# Altium schematic sheet acf_schematic.SchDoc: Устройство сжатия
size 1188 x 840 mm; CheckedBy: Леонидов В.В.; Author: Добротин А.А.; SheetNumber: 1; SheetTotal: 2; CompanyName1: МГТУ им. Н.Э.Баумана; CompanyName2: Кафедра ИУ4; CompanyName3: Группа ИУ4-81Б; Title2str: аудиоданных; DocumentType: Схема электрическая принципиальная; Scale: 1:1; FirstReferrence: АБВГ.123456.001
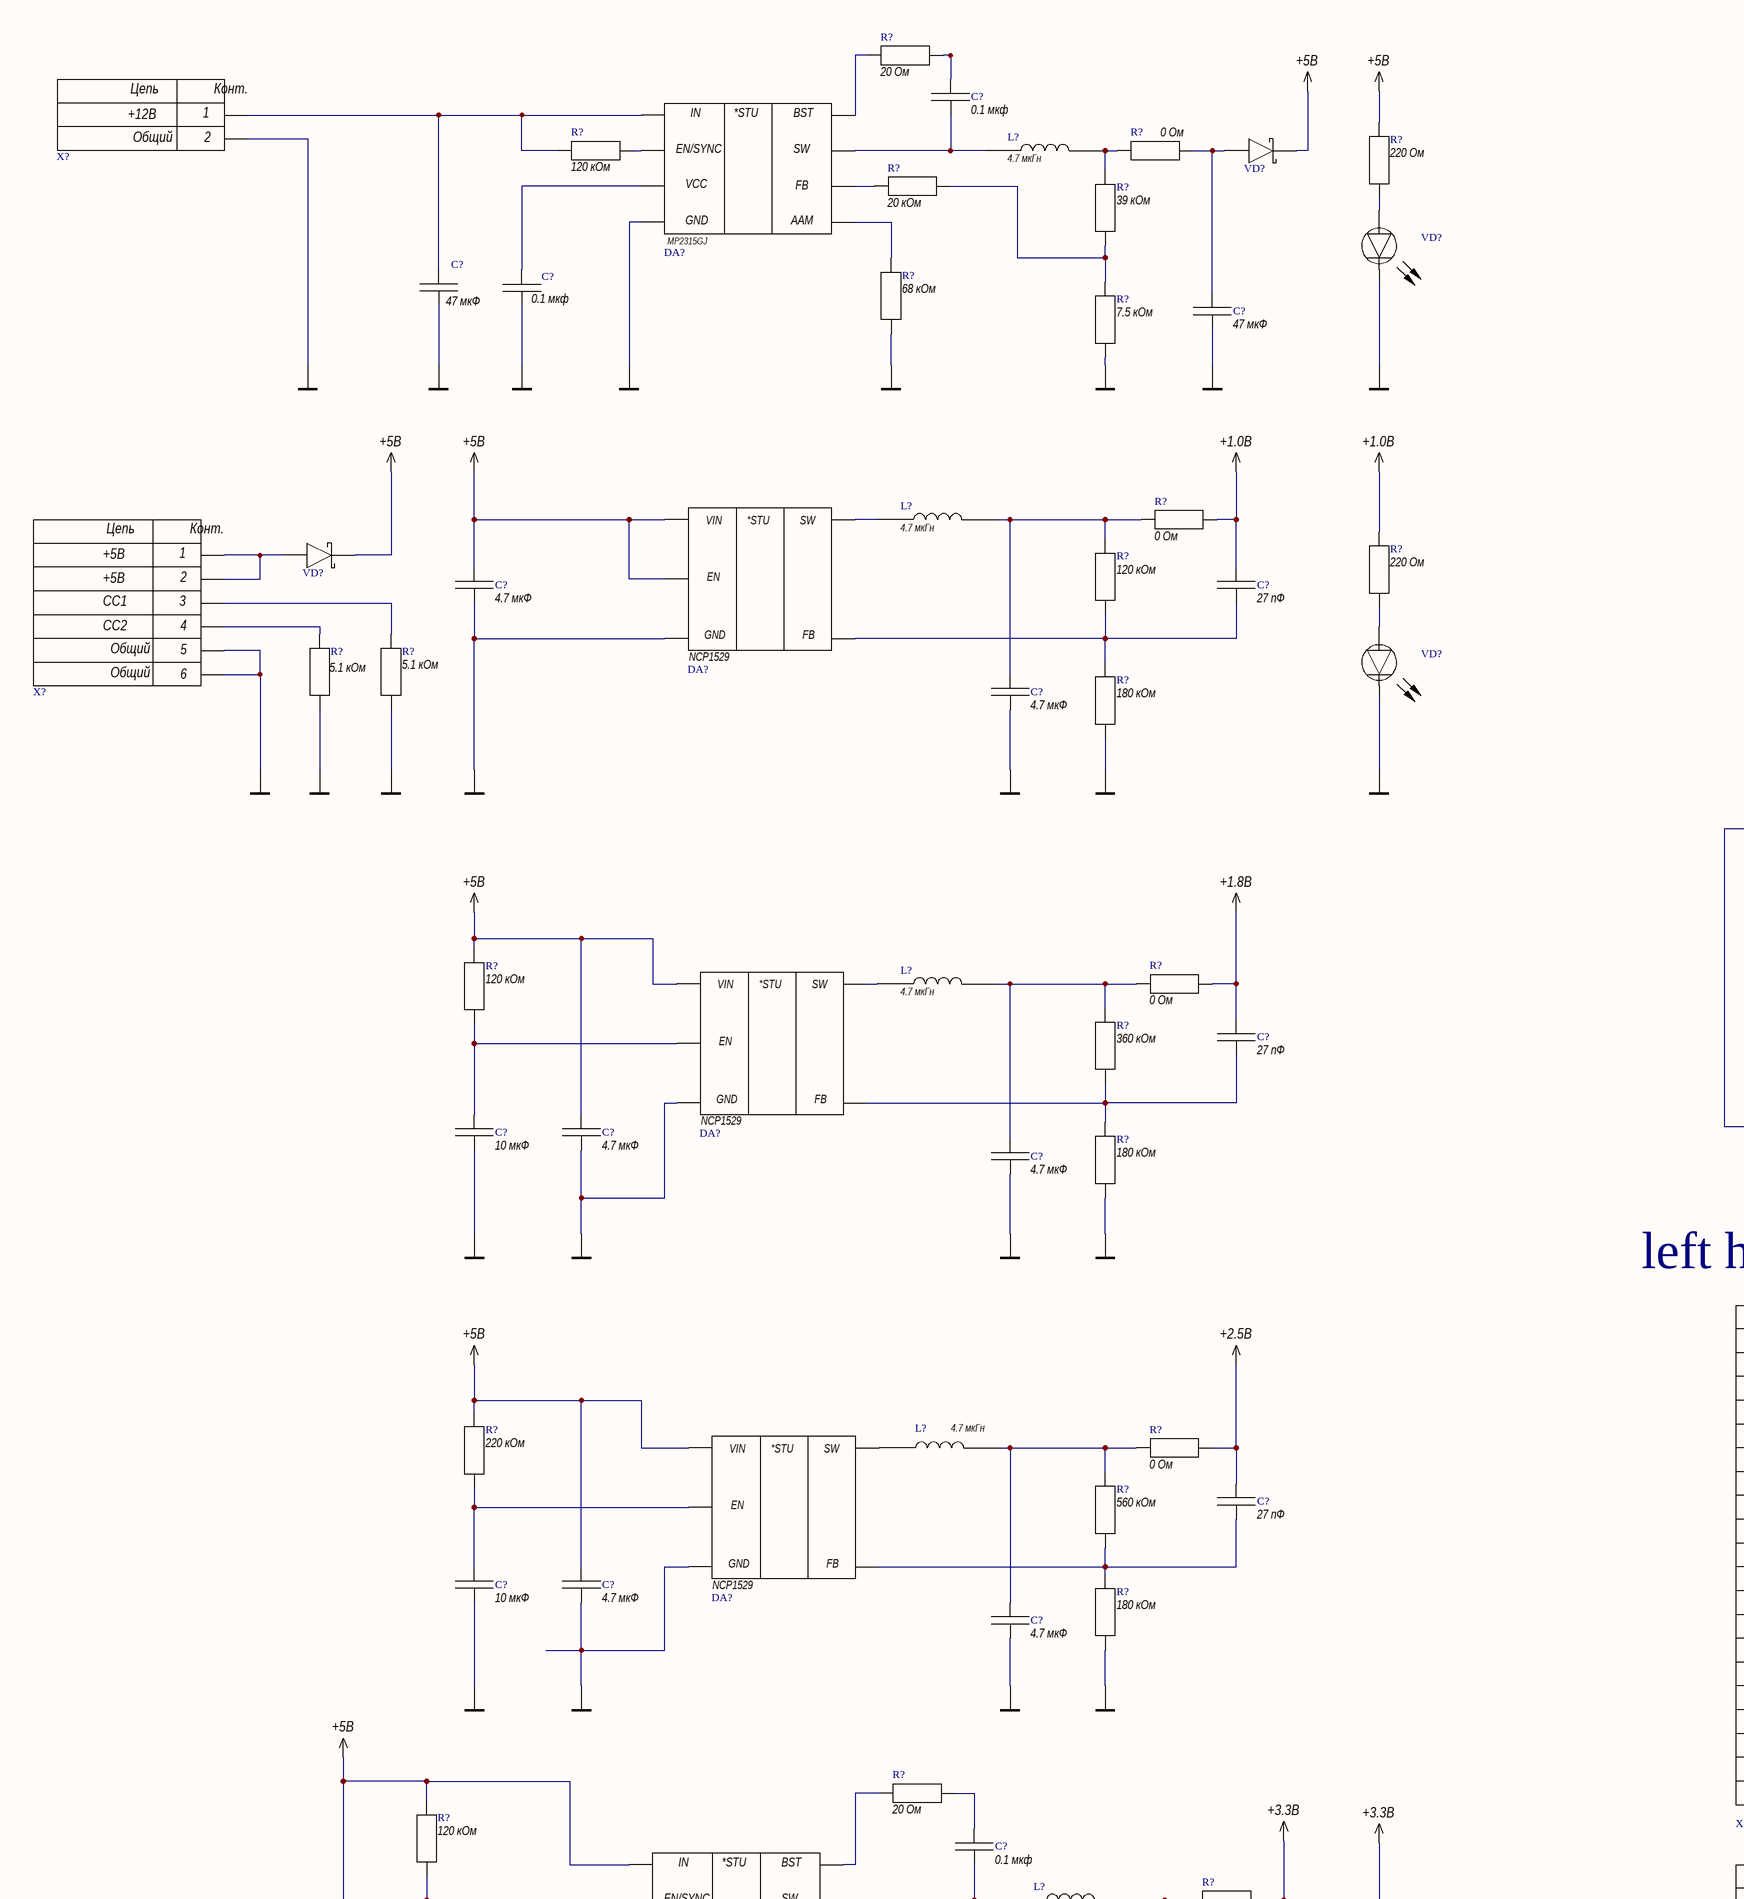
[diagram p0: acf_schematic.SchDoc, top left]
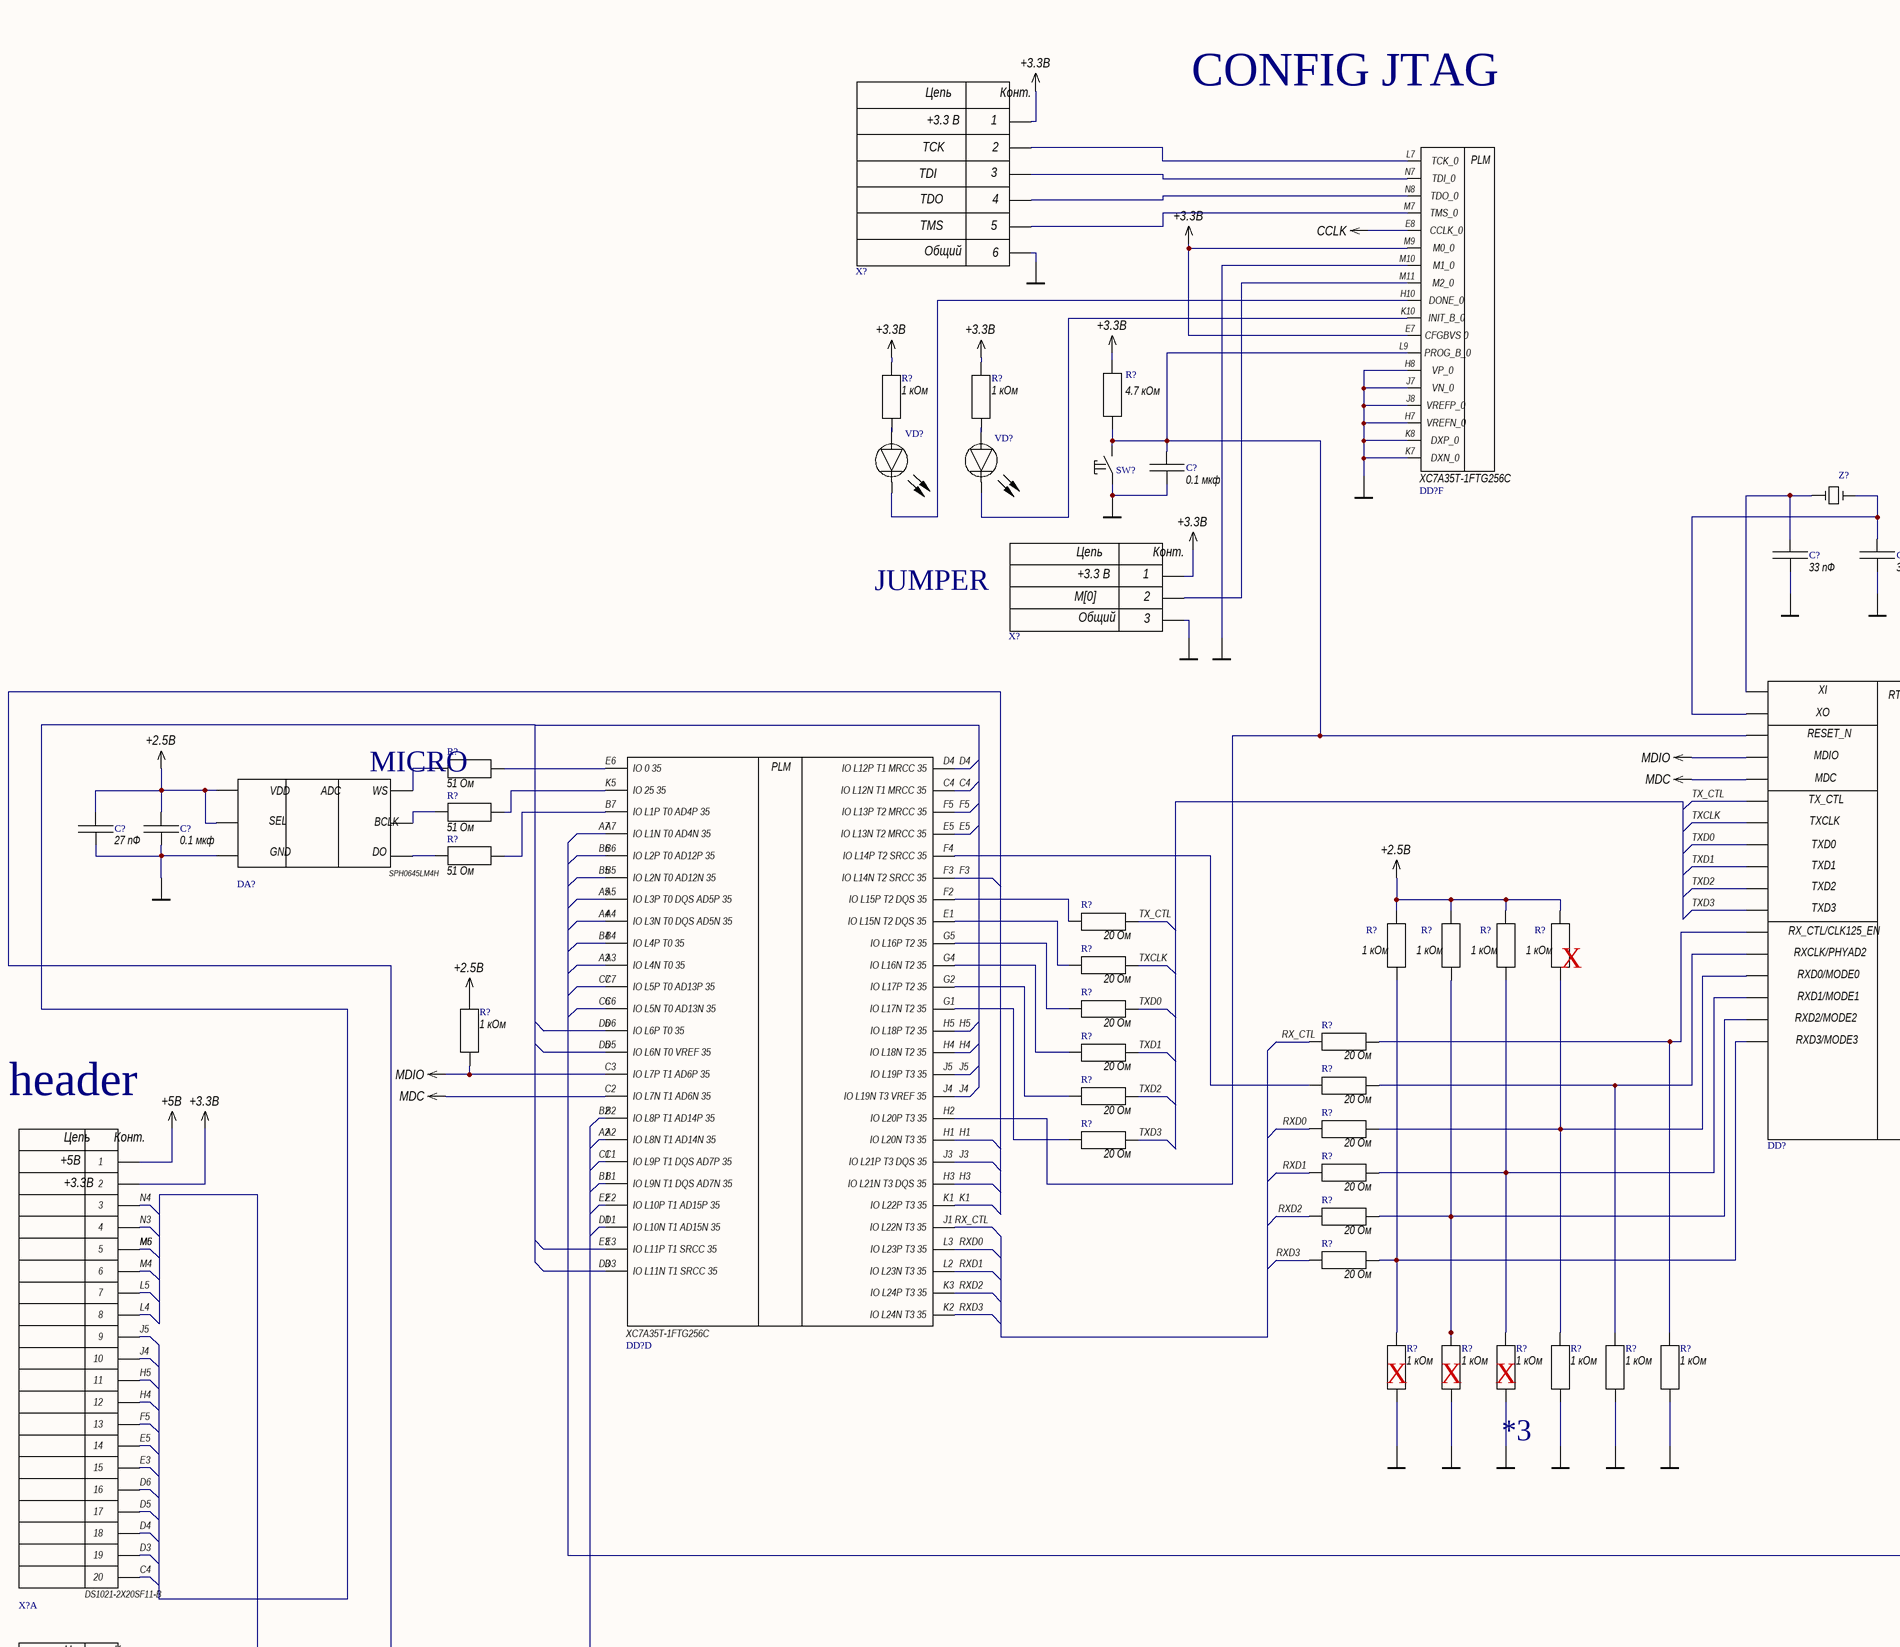
[diagram p1: acf_schematic.SchDoc, top middle]
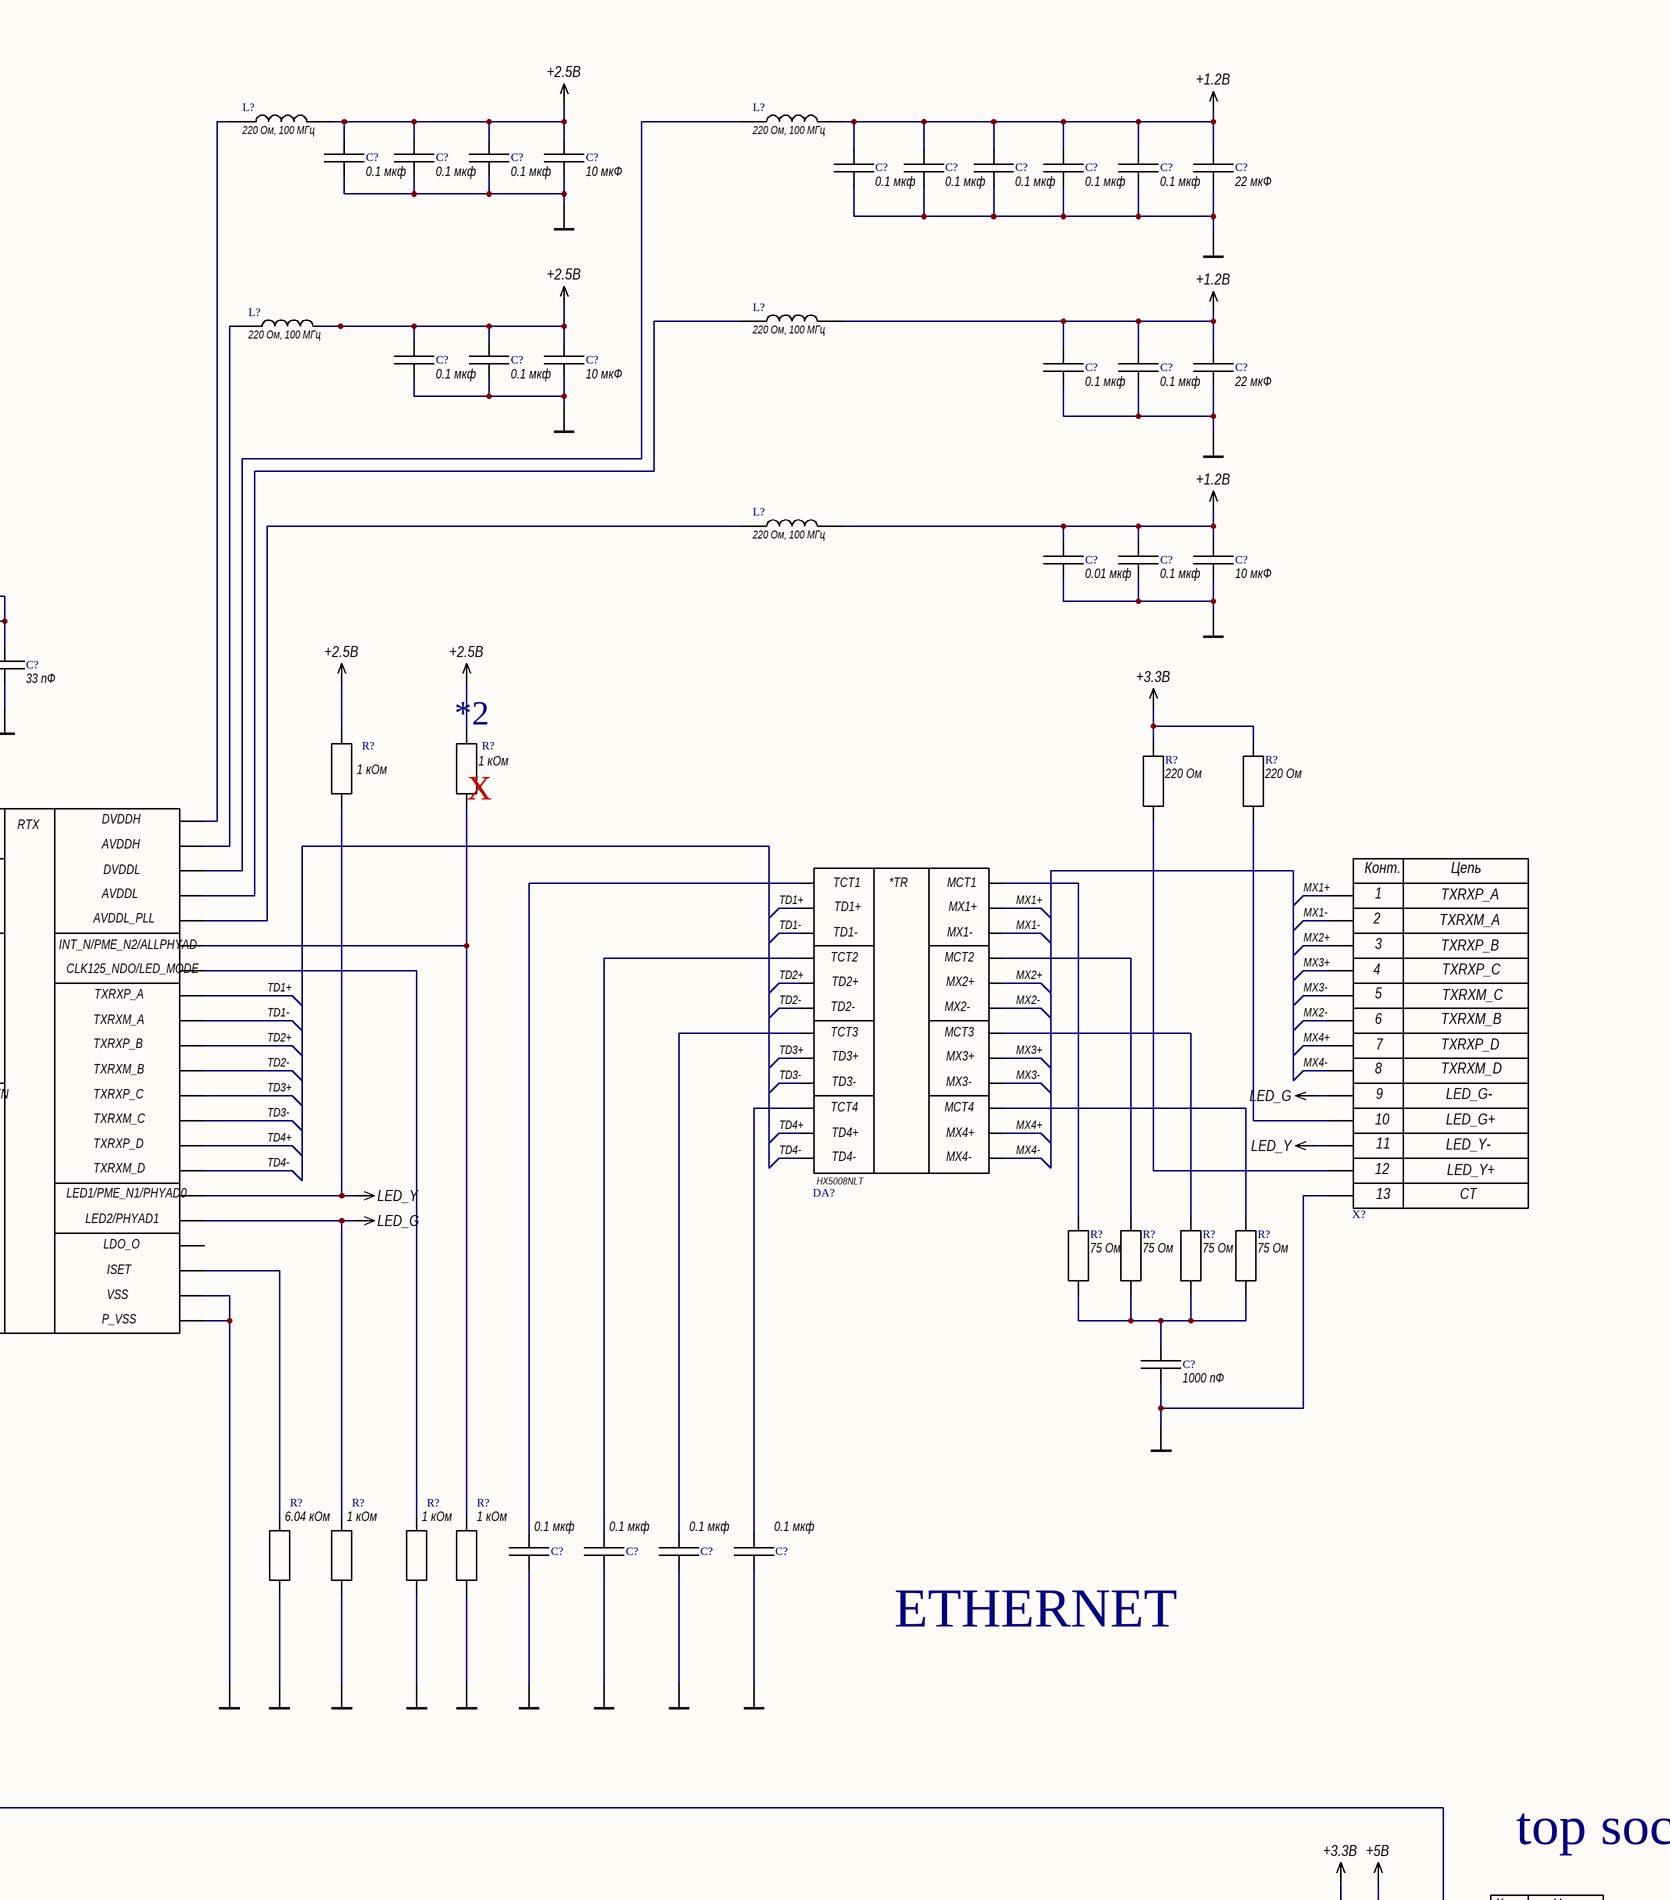
[diagram p2: acf_schematic.SchDoc, top right]
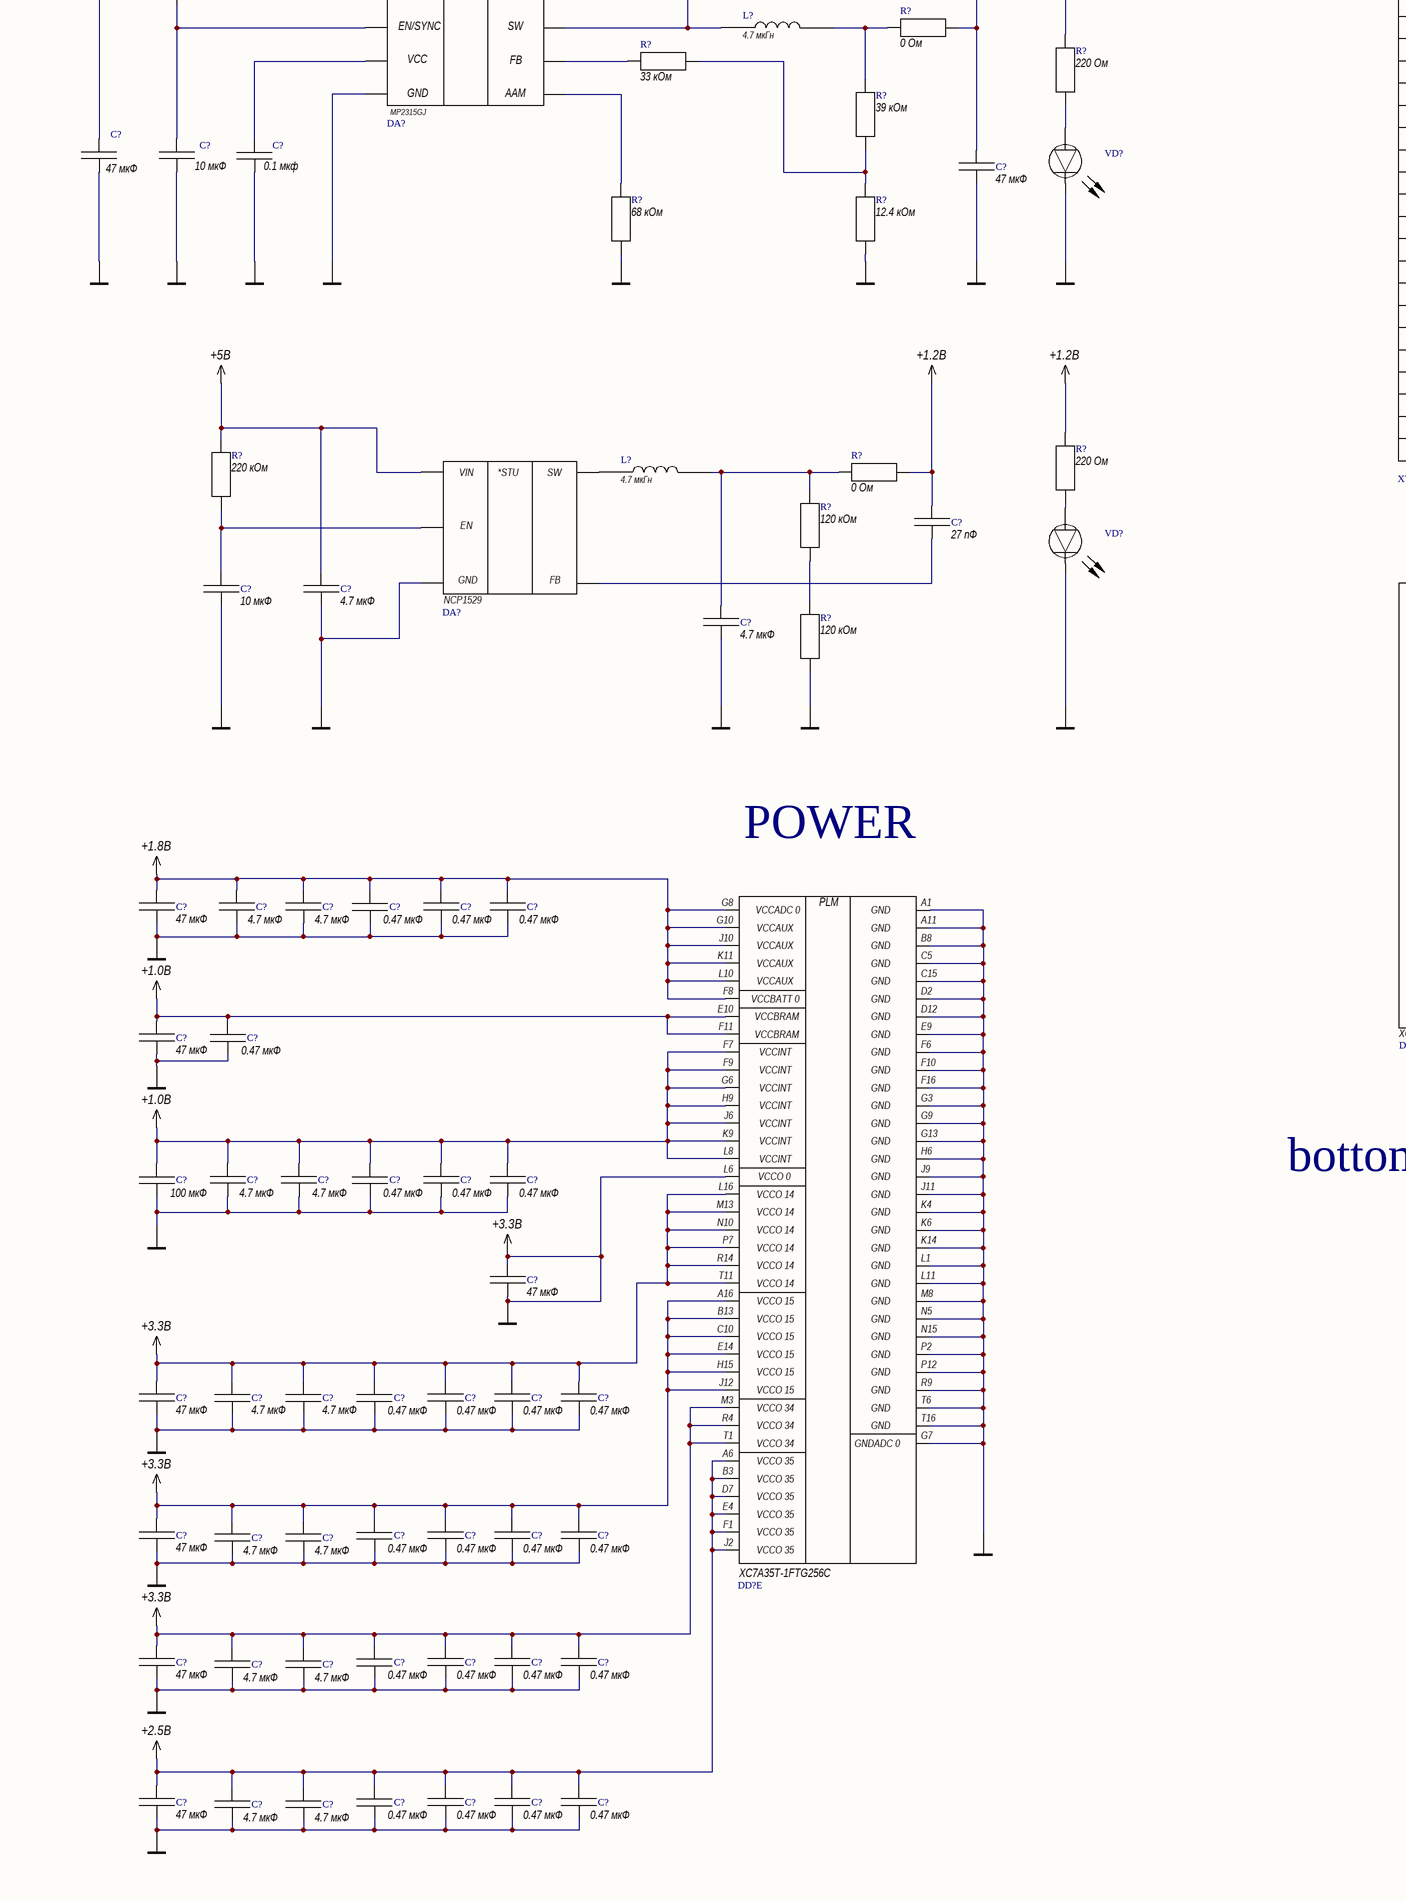
[diagram p3: acf_schematic.SchDoc, bottom left]
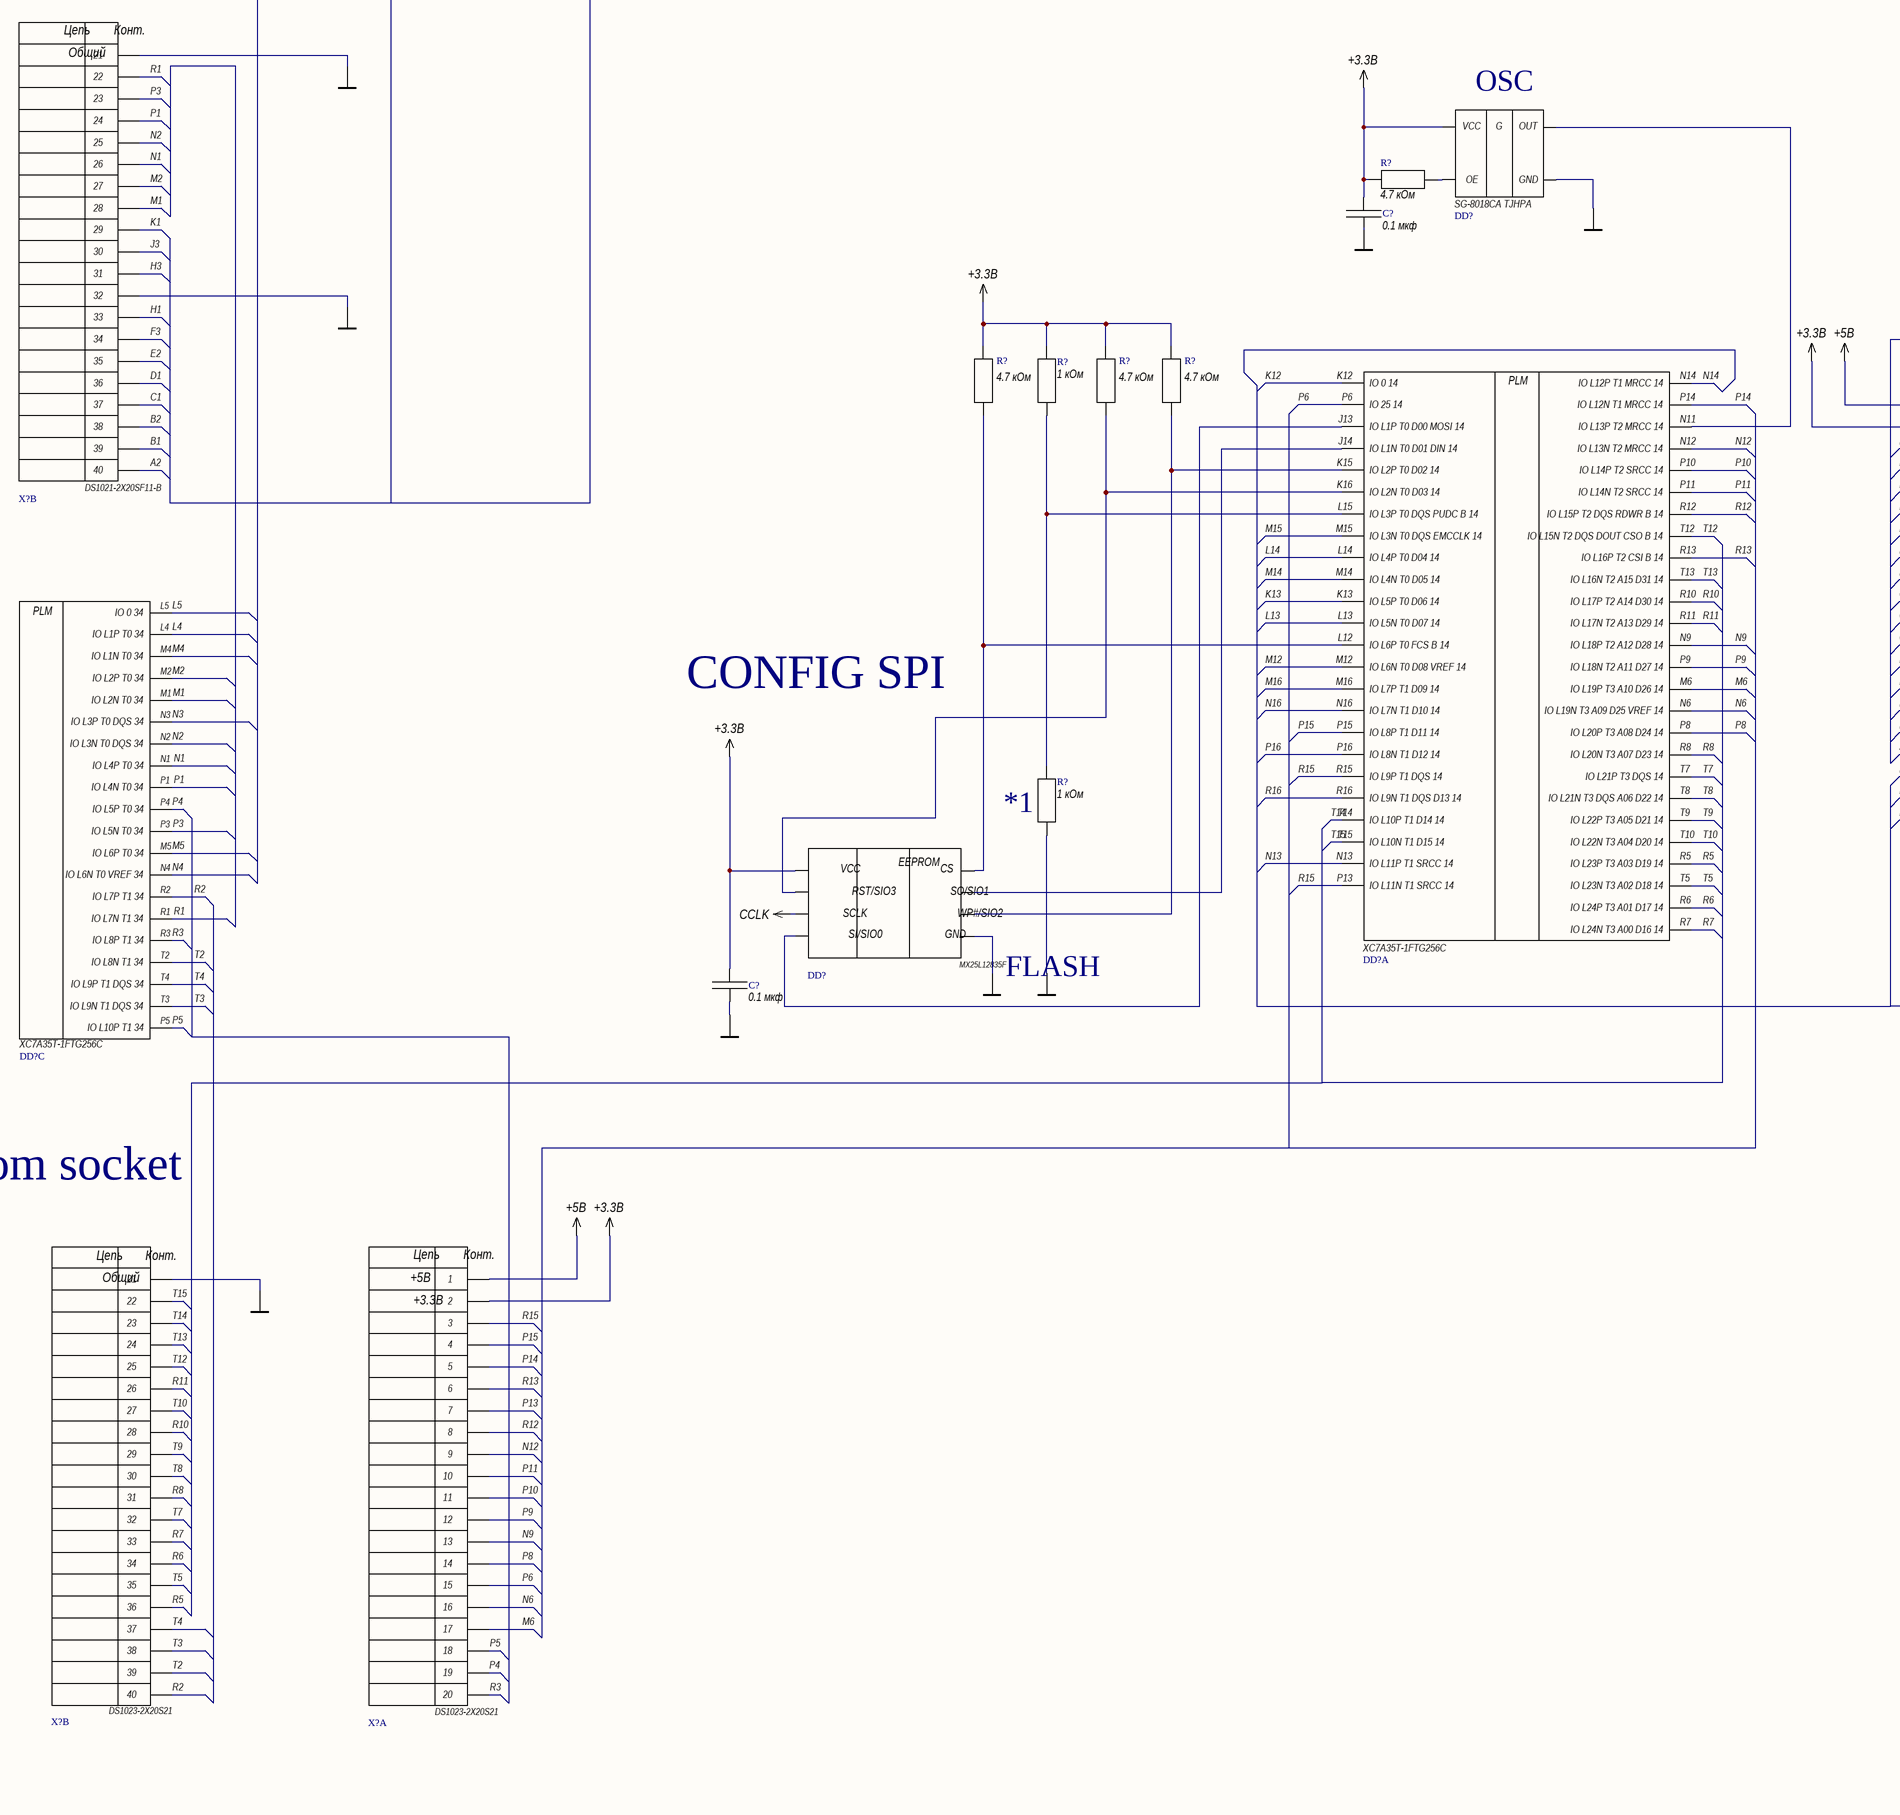
[diagram p4: acf_schematic.SchDoc, bottom middle]
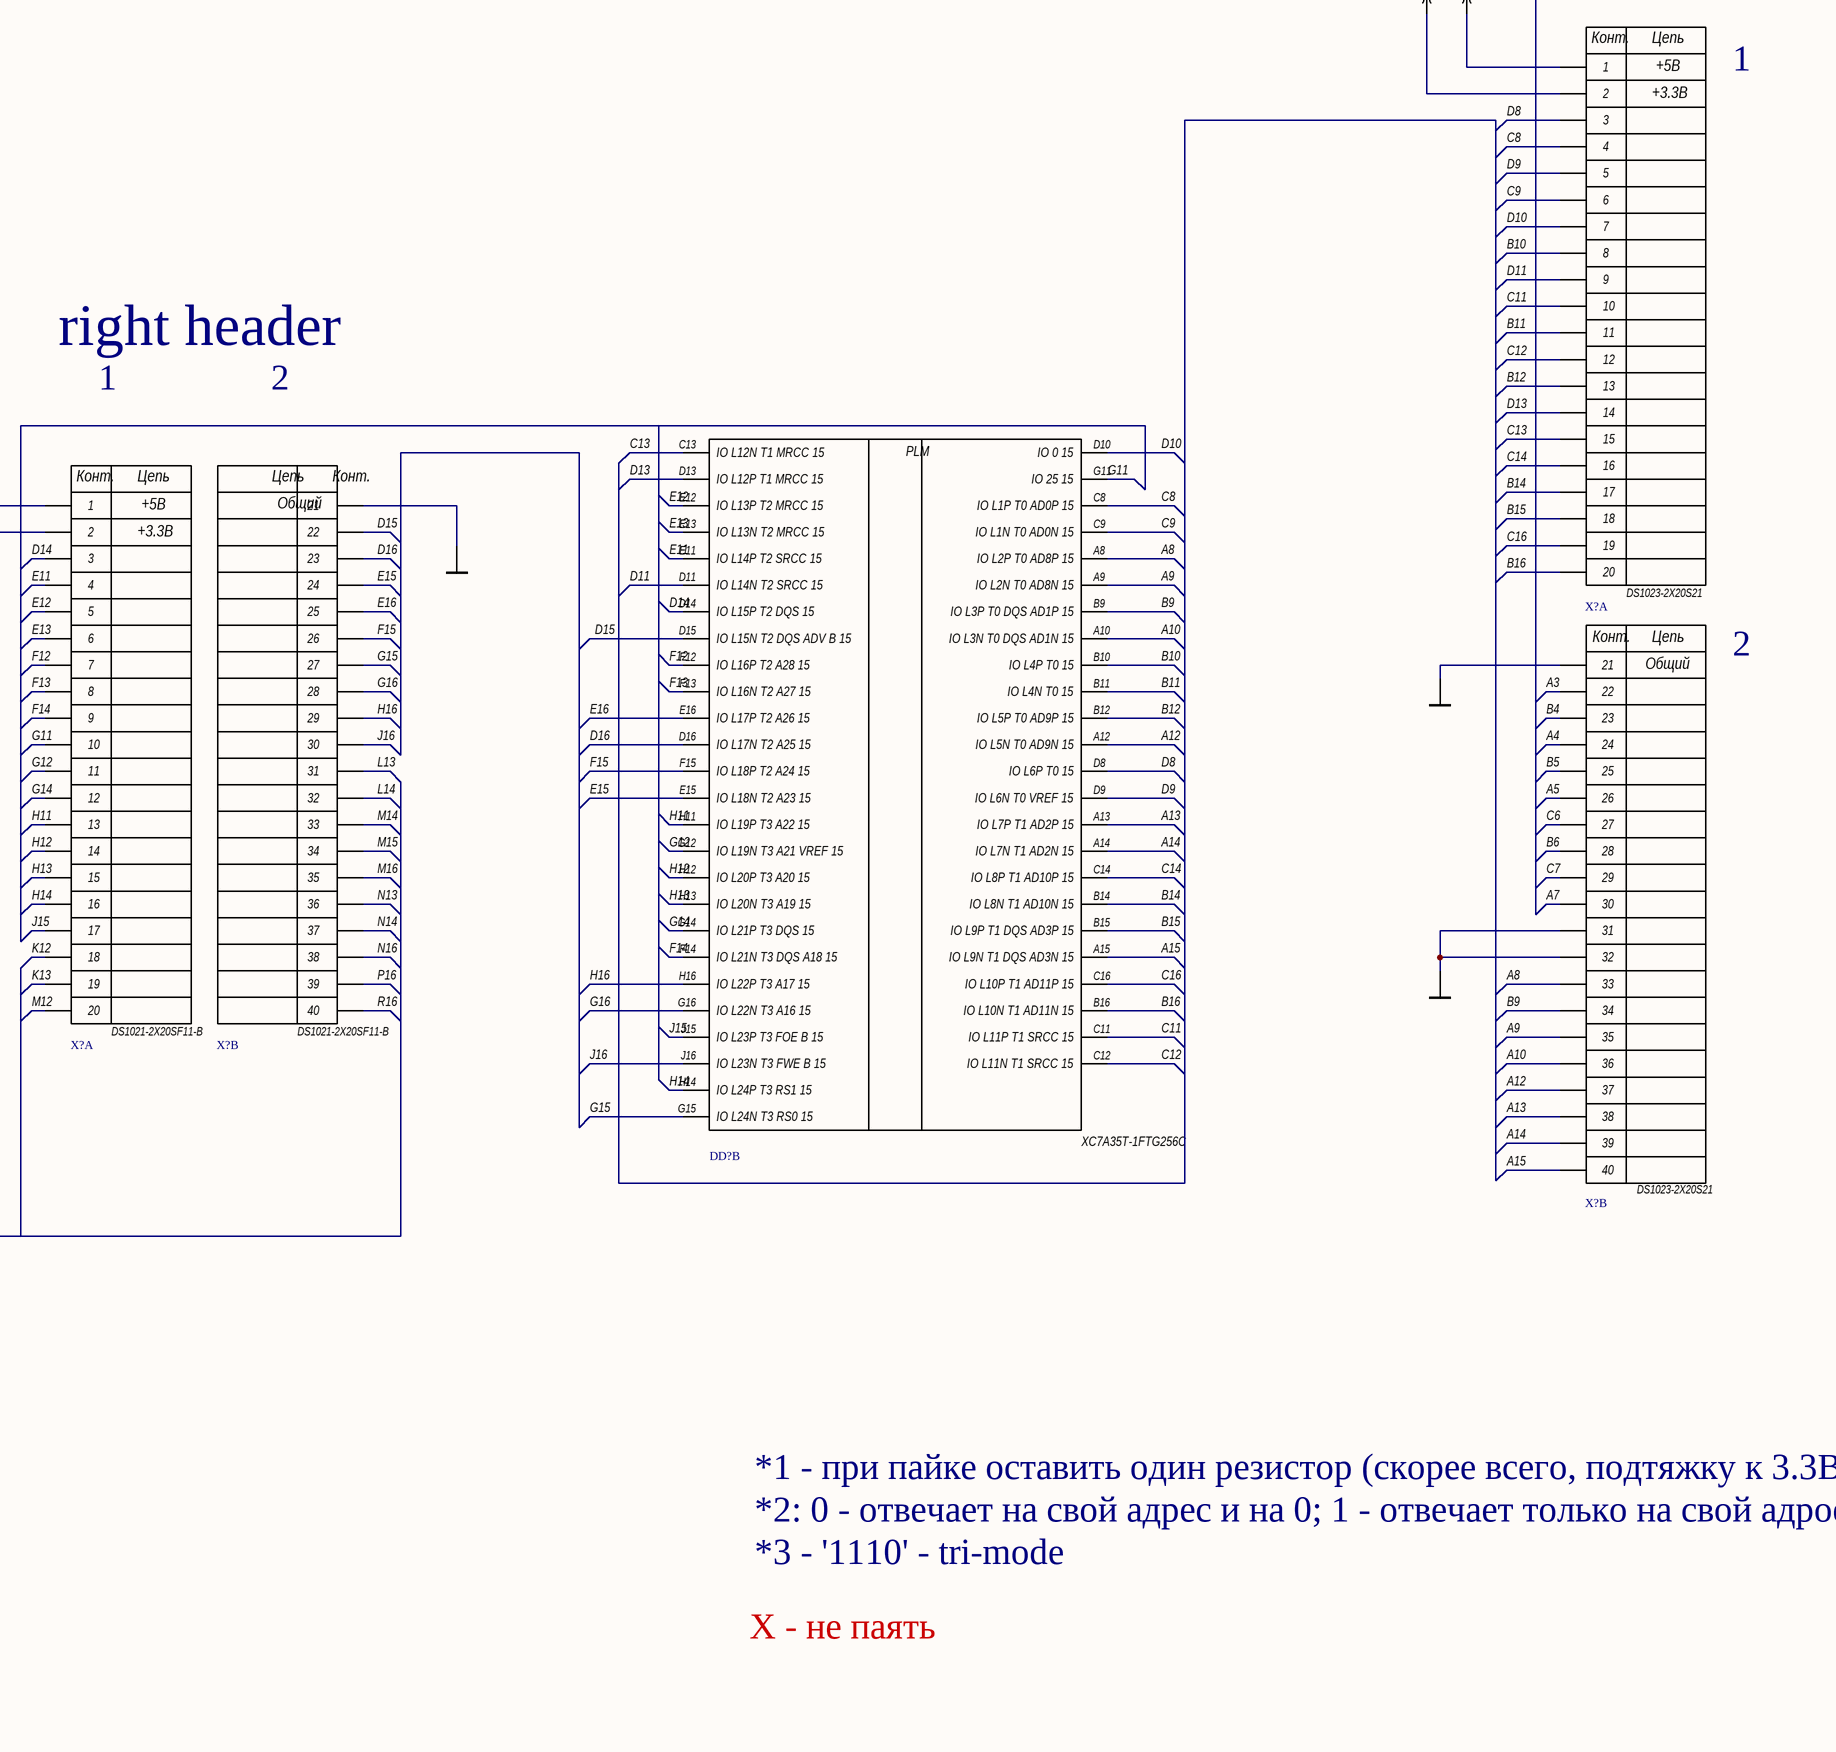
[diagram p5: acf_schematic.SchDoc, bottom right]

## Parts
(Parts that share a designator on the sheet are numbered #1, #2 ... from top to bottom, then left to right.)
C?#1  0.1 мкф  [1206_Med_Dens]
C?#2  Значение: 0.1 мкф  [CC0603-DA-IPC_B]  (hidden comment: 0.1 мкф (0603))
C?#3  Значение: 0.1 мкф  [CC0603-DA-IPC_B]  (hidden comment: 0.1 мкф (0603))
C?#4  10 мкф  [CC0603-DA-IPC_B]
C?#5  Значение: 0.1 мкф  [CC0603-DA-IPC_B]  (hidden comment: 0.1 мкф (0603))
C?#6  Значение: 0.1 мкф  [CC0603-DA-IPC_B]  (hidden comment: 0.1 мкф (0603))
C?#7  Значение: 0.1 мкф  [CC0603-DA-IPC_B]  (hidden comment: 0.1 мкф (0603))
C?#8  Значение: 0.1 мкф  [CC0603-DA-IPC_B]  (hidden comment: 0.1 мкф (0603))
C?#9  Значение: 0.1 мкф  [CC0603-DA-IPC_B]  (hidden comment: 0.1 мкф (0603))
C?#10  Значение: 0.1 мкф  [CC0603-DA-IPC_B]  (hidden comment: 0.1 мкф (0603))
C?#11  22 мкФ  [CC0603-DA-IPC_B]
C?#12  0.1 мкф  [1206_Med_Dens]
C?#13  47 мкф  [1206_Med_Dens]
C?#14  Значение: 47 мкФ  [1206_Med_Dens]  (hidden comment: GRM31CR61E476ME44L)
C?#15  Значение: 0.1 мкф  [CC0603-DA-IPC_B]  (hidden comment: 0.1 мкф (0603))
C?#16  10 мкф  [CC0603-DA-IPC_B]
C?#17  Значение: 0.1 мкф  [CC0603-DA-IPC_B]  (hidden comment: 0.1 мкф (0603))
C?#18  Значение: 0.1 мкф  [CC0603-DA-IPC_B]  (hidden comment: 0.1 мкф (0603))
C?#19  Значение: 0.1 мкф  [CC0603-DA-IPC_B]  (hidden comment: 0.1 мкф (0603))
C?#20  22 мкФ  [CC0603-DA-IPC_B]
C?#21  Значение: 0.1 мкф  [CC0603-DA-IPC_B]  (hidden comment: 0.1 мкф (0603))
C?#22  0.01 мкф  [CC0603-DA-IPC_B]
C?#23  10 мкф  [CC0603-DA-IPC_B]
C?#24  Значение: 4.7 мкФ  [0805_MED_DENS_MURATA]  (hidden comment: GRM21BR71A475KA73L)
C?#25  Значение: 27 пФ  [0805_MED_DENS_MURATA]  (hidden comment: GRM21BR61H270KA01D)
C?#26  0.1 мкф  [1206_Med_Dens]
C?#27  Значение: 33 пФ  [CC0603-DA-IPC_B]  (hidden comment: 33 пФ (0603))
C?#28  Значение: 33 пФ  [CC0603-DA-IPC_B]  (hidden comment: 33 пФ (0603))
C?#29  Значение: 4.7 мкФ  [0805_MED_DENS_MURATA]  (hidden comment: GRM21BR71A475KA73L)
C?#30  27 пф  [0805_MED_DENS_MURATA]
C?#31  0.1 мкф  [1206_Med_Dens]
C?#32  Значение: 27 пФ  [0805_MED_DENS_MURATA]  (hidden comment: GRM21BR61H270KA01D)
C?#33  Значение: 10 мкФ  (hidden comment: CL10A106MQ8NNNC)
C?#34  Значение: 4.7 мкФ  [0805_MED_DENS_MURATA]  (hidden comment: GRM21BR71A475KA73L)
C?#35  Значение: 4.7 мкФ  [0805_MED_DENS_MURATA]  (hidden comment: GRM21BR71A475KA73L)
C?#36  1000 пФ  [CK45-B3DD102KYGNA (CAP)]
C?#37  Значение: 27 пФ  [0805_MED_DENS_MURATA]  (hidden comment: GRM21BR61H270KA01D)
C?#38  0.1 мкф  [1206_Med_Dens]
C?#39  0.1 мкф  [1206_Med_Dens]
C?#40  0.1 мкф  [1206_Med_Dens]
C?#41  0.1 мкф  [1206_Med_Dens]
C?#42  Значение: 10 мкФ  (hidden comment: CL10A106MQ8NNNC)
C?#43  Значение: 4.7 мкФ  [0805_MED_DENS_MURATA]  (hidden comment: GRM21BR71A475KA73L)
C?#44  Значение: 4.7 мкФ  [0805_MED_DENS_MURATA]  (hidden comment: GRM21BR71A475KA73L)
C?#45  0.1 мкф  [1206_Med_Dens]
C?#46  0.1 мкф  [1206_Med_Dens]
C?#47  47 мкф  [1206_Med_Dens]
C?#48  Значение: 10 мкФ  (hidden comment: CL10A106MQ8NNNC)
C?#49  Значение: 47 мкФ  [1206_Med_Dens]  (hidden comment: GRM31CR61E476ME44L)
C?#50  0.1 мкф  [1206_Med_Dens]
C?#51  Значение: 27 пФ  [0805_MED_DENS_MURATA]  (hidden comment: GRM21BR61H270KA01D)
C?#52  Значение: 10 мкФ  (hidden comment: CL10A106MQ8NNNC)
C?#53  Значение: 4.7 мкФ  [0805_MED_DENS_MURATA]  (hidden comment: GRM21BR71A475KA73L)
C?#54  Значение: 4.7 мкФ  [0805_MED_DENS_MURATA]  (hidden comment: GRM21BR71A475KA73L)
C?#55  0.47 мкф  [0402_Medium_Density]
C?#56  47 мкф  [1206_Med_Dens]
C?#57  4.7 мкф  [0805_MED_DENS_MURATA]
C?#58  4.7 мкф  [0805_MED_DENS_MURATA]
C?#59  0.47 мкф  [0402_Medium_Density]
C?#60  0.47 мкф  [0402_Medium_Density]
C?#61  0.1 мкф  [1206_Med_Dens]
C?#62  0.47 мкф  [0402_Medium_Density]
C?#63  47 мкф  [1206_Med_Dens]
C?#64  100 мкФ  [1206_IPC_A_samsung]
C?#65  0.47 мкф  [0402_Medium_Density]
C?#66  4.7 мкф  [0805_MED_DENS_MURATA]
C?#67  4.7 мкф  [0805_MED_DENS_MURATA]
C?#68  0.47 мкф  [0402_Medium_Density]
C?#69  0.47 мкф  [0402_Medium_Density]
C?#70  47 мкф  [1206_Med_Dens]
C?#71  4.7 мкф  [0805_MED_DENS_MURATA]
C?#72  4.7 мкф  [0805_MED_DENS_MURATA]
C?#73  0.47 мкф  [0402_Medium_Density]
C?#74  47 мкф  [1206_Med_Dens]
C?#75  0.47 мкф  [0402_Medium_Density]
C?#76  0.47 мкф  [0402_Medium_Density]
C?#77  0.47 мкф  [0402_Medium_Density]
C?#78  0.47 мкф  [0402_Medium_Density]
C?#79  47 мкф  [1206_Med_Dens]
C?#80  0.47 мкф  [0402_Medium_Density]
C?#81  0.47 мкф  [0402_Medium_Density]
C?#82  0.47 мкф  [0402_Medium_Density]
C?#83  4.7 мкф  [0805_MED_DENS_MURATA]
C?#84  4.7 мкф  [0805_MED_DENS_MURATA]
C?#85  0.47 мкф  [0402_Medium_Density]
C?#86  47 мкф  [1206_Med_Dens]
C?#87  4.7 мкф  [0805_MED_DENS_MURATA]
C?#88  4.7 мкф  [0805_MED_DENS_MURATA]
C?#89  0.47 мкф  [0402_Medium_Density]
C?#90  0.47 мкф  [0402_Medium_Density]
C?#91  0.47 мкф  [0402_Medium_Density]
C?#92  0.47 мкф  [0402_Medium_Density]
C?#93  47 мкф  [1206_Med_Dens]
C?#94  4.7 мкф  [0805_MED_DENS_MURATA]
C?#95  4.7 мкф  [0805_MED_DENS_MURATA]
C?#96  0.47 мкф  [0402_Medium_Density]
C?#97  0.47 мкф  [0402_Medium_Density]
C?#98  0.47 мкф  [0402_Medium_Density]
DA?#1  DC-DC  [TSTO23-8]  (value not drawn)
DA?#2  DC-DC  [TSOT23-5 (TSOP5)]  (value not drawn)
DA?#3  Microphone  [MIC_SPH0645LM4H-B]  (value not drawn)
DA?#4  DC-DC  [TSOT23-5 (TSOP5)]  (value not drawn)
DA?#5  Magnetics  (value not drawn)
DA?#6  DC-DC  [TSOT23-5 (TSOP5)]  (value not drawn)
DA?#7  DC-DC  [TSTO23-8]  (value not drawn)
DA?#8  DC-DC  [TSOT23-5 (TSOP5)]  (value not drawn)
DD?#1  FPGA  [FP-XC7A35T-1FTG256C-MFG]  (value not drawn)  (part F of 6)
DD?#2  PHY ETH  [FP-QFN77-48LD-PL-1-MFG]  (value not drawn)
DD?#3  FPGA  [FP-XC7A35T-1FTG256C-MFG]  (value not drawn)  (part D of 6)
DD?#4  SG-8018CA TJHPA  [OSC_SG-8018CA_50.2600M-TJHPA0]  (value not drawn)
DD?#5  FPGA  [FP-XC7A35T-1FTG256C-MFG]  (value not drawn)  (part B of 6)
DD?#6  FPGA  [FP-XC7A35T-1FTG256C-MFG]  (value not drawn)  (part A of 6)
DD?#7  QSPI Flash  [MX25L12835FM2I-10G]  (value not drawn)
DD?#8  FPGA  [FP-XC7A35T-1FTG256C-MFG]  (value not drawn)  (part C of 6)
DD?#9  XC7A35T-1FTG256C  [FP-XC7A35T-1FTG256C-MFG]  (value not drawn)  (part E of 6)
L?#1  Значение: 4.7 мкГн  [IND_VLS6045EX-4R7M-H]  (hidden comment: VLS6045EX-4R7M-H)
L?#2  Значение: 220 Ом, 100 МГц  [MMZ1608-0_8-MFG]  (hidden comment: Ферритовый фильтр 220 Ом 100 МГц)
L?#3  Значение: 220 Ом, 100 МГц  [MMZ1608-0_8-MFG]  (hidden comment: Ферритовый фильтр 220 Ом 100 МГц)
L?#4  Значение: 220 Ом, 100 МГц  [MMZ1608-0_8-MFG]  (hidden comment: Ферритовый фильтр 220 Ом 100 МГц)
L?#5  Значение: 220 Ом, 100 МГц  [MMZ1608-0_8-MFG]  (hidden comment: Ферритовый фильтр 220 Ом 100 МГц)
L?#6  Значение: 4.7 мкГн  [IND_VLS6045EX-4R7M-H]  (hidden comment: VLS6045EX-4R7M-H)
L?#7  Значение: 220 Ом, 100 МГц  [MMZ1608-0_8-MFG]  (hidden comment: Ферритовый фильтр 220 Ом 100 МГц)
L?#8  Значение: 4.7 мкГн  [IND_VLS6045EX-4R7M-H]  (hidden comment: VLS6045EX-4R7M-H)
L?#9  Значение: 4.7 мкГн  [IND_VLS6045EX-4R7M-H]  (hidden comment: VLS6045EX-4R7M-H)
L?#10  Значение: 4.7 мкГн  [IND_VLS6045EX-4R7M-H]  (hidden comment: VLS6045EX-4R7M-H)
L?#11  Значение: 4.7 мкГн  [IND_VLS6045EX-4R7M-H]  (hidden comment: VLS6045EX-4R7M-H)
R?#1  20 Ом  [RESC2012X60N (0805)]
R?#2  120 кОм  [RESC6331X70N (2512)]
R?#3  0 Ом  [RESC2012X60N (0805)]
R?#4  220 Ом  [RESC2012X60N (0805)]
R?#5  20 кОм  [RESC1608X55X25(0603 res)]
R?#6  39 кОм  [RESC1608X55X25(0603 res)]
R?#7  68 кОм  [RESC2012X60N (0805)]
R?#8  7.5 кОм  [RESC1608X55X25(0603 res)]
R?#9  0 Ом  [RESC2012X60N (0805)]
R?#10  1 кОм  [RC1206-IPC_A]
R?#11  1 кОм  [RC1206-IPC_A]
R?#12  4.7 кОм  [RESC2012X60N (0805)]
R?#13  220 Ом  [RESC2012X60N (0805)]
R?#14  Значение: 120 кОм  [RESC6331X70N (2512)]  (hidden comment: RC2512FR-07120KL)
R?#15  5.1 кОм  [RESC2012X60N (0805)]
R?#16  5.1 кОм  [RESC2012X60N (0805)]
R?#17  Значение: 180 кОм  [RESC6331X70N (2512)]  (hidden comment: RC2512FR-07180KL)
R?#18  1 кОм  [RC1206-IPC_A]
R?#19  1 кОм  [RC1206-IPC_A]
R?#20  220 Ом  [RESC2012X60N (0805)]
R?#21  220 Ом  [RESC2012X60N (0805)]
R?#22  51 Ом  [RESC2012X60N (0805)]
R?#23  51 Ом  [RESC2012X60N (0805)]
R?#24  0 Ом  [RESC2012X60N (0805)]
R?#25  Значение: 120 кОм  [RESC6331X70N (2512)]  (hidden comment: RC2512FR-07120KL)
R?#26  51 Ом  [RESC2012X60N (0805)]
R?#27  Значение: 360 кОм  [RESC6331X70N (2512)]  (hidden comment: RC2512FR-07360KL)
R?#28  20 Ом  [RESC2012X60N (0805)]
R?#29  1 кОм  [RC1206-IPC_A]
R?#30  1 кОм  [RC1206-IPC_A]
R?#31  1 кОм  [RC1206-IPC_A]
R?#32  1 кОм  [RC1206-IPC_A]
R?#33  20 Ом  [RESC2012X60N (0805)]
R?#34  20 Ом  [RESC2012X60N (0805)]
R?#35  Значение: 180 кОм  [RESC6331X70N (2512)]  (hidden comment: RC2512FR-07180KL)
R?#36  20 Ом  [RESC2012X60N (0805)]
R?#37  20 Ом  [RESC2012X60N (0805)]
R?#38  1 кОм  [RC1206-IPC_A]
R?#39  20 Ом  [RESC2012X60N (0805)]
R?#40  20 Ом  [RESC2012X60N (0805)]
R?#41  75 Ом  [RC1206-IPC_A]
R?#42  75 Ом  [RC1206-IPC_A]
R?#43  75 Ом  [RC1206-IPC_A]
R?#44  75 Ом  [RC1206-IPC_A]
R?#45  20 Ом  [RESC2012X60N (0805)]
R?#46  20 Ом  [RESC2012X60N (0805)]
R?#47  20 Ом  [RESC2012X60N (0805)]
R?#48  20 Ом  [RESC2012X60N (0805)]
R?#49  20 Ом  [RESC2012X60N (0805)]
R?#50  0 Ом  [RESC2012X60N (0805)]
R?#51  Значение: 220 кОм  [RESC6331X70N (2512)]  (hidden comment: CR0805-JW-224ELF)
R?#52  6.04 кОм  [RESC1005 (0402)]
R?#53  1 кОм  [RC1206-IPC_A]
R?#54  560 кОм  [RESC2012X60N (0805)]
R?#55  1 кОм  [RC1206-IPC_A]
R?#56  1 кОм  [RC1206-IPC_A]
R?#57  1 кОм  [RC1206-IPC_A]
R?#58  1 кОм  [RC1206-IPC_A]
R?#59  1 кОм  [RC1206-IPC_A]
R?#60  1 кОм  [RC1206-IPC_A]
R?#61  1 кОм  [RC1206-IPC_A]
R?#62  1 кОм  [RC1206-IPC_A]
R?#63  180 кОм  [RESC6331X70N (2512)]
R?#64  20 Ом  [RESC2012X60N (0805)]
R?#65  120 кОм  [RESC6331X70N (2512)]
R?#66  0 Ом  [RESC2012X60N (0805)]
R?#67  33 кОм  [RESC2012X60N (0805)]
R?#68  220 Ом  [RESC2012X60N (0805)]
R?#69  39 кОм  [RESC1608X55X25(0603 res)]
R?#70  4.7 кОм  [RESC2012X60N (0805)]
R?#71  68 кОм  [RESC2012X60N (0805)]
R?#72  12.4 кОм  [RESC1608X55X25(0603 res)]
R?#73  4.7 кОм  [RESC2012X60N (0805)]
R?#74  1 кОм  [RC1206-IPC_A]
R?#75  4.7 кОм  [RESC2012X60N (0805)]
R?#76  4.7 кОм  [RESC2012X60N (0805)]
R?#77  0 Ом  [RESC2012X60N (0805)]
R?#78  220 Ом  [RESC2012X60N (0805)]
R?#79  Значение: 220 кОм  [RESC6331X70N (2512)]  (hidden comment: CR0805-JW-224ELF)
R?#80  Значение: 120 кОм  [RESC6331X70N (2512)]  (hidden comment: RC2512FR-07120KL)
R?#81  Значение: 120 кОм  [RESC6331X70N (2512)]  (hidden comment: RC2512FR-07120KL)
R?#82  1 кОм  [RC1206-IPC_A]
SW?  Кнопка  [BUTTON]  (value not drawn)
VD?#1  Schottky diode, 5A, 30V (360 mV)  [SOD128-MFG]  (value not drawn)
VD?#2  green led  [KING-0603LED_GREEN_V]  (value not drawn)
VD?#3  blue led  [KING-0603LED_GREEN_V]  (value not drawn)
VD?#4  blue led  [KING-0603LED_GREEN_V]  (value not drawn)
VD?#5  Schottky diode, 5A, 30V (360 mV)  [SOD128-MFG]  (value not drawn)
VD?#6  green led  [KING-0603LED_GREEN_V]  (value not drawn)
VD?#7  green led  [KING-0603LED_GREEN_V]  (value not drawn)
VD?#8  green led  [KING-0603LED_GREEN_V]  (value not drawn)
X?#1  DC Power Jack  [DC POWER JACK (5.5x2.5mm)]  (value not drawn)
X?#2  14 pin header (jtag)  [SAMTEC-TST-107-01 (14PIN)]  (value not drawn)
X?#3  USB Type-C  [USB TYPE-C 6 pins]  (value not drawn)
X?#4  3 pin header  [PLS-3 (DS1021-1x3)]  (value not drawn)
X?#5  ethernet connector  [RJHSE-5381_ETHERNET]  (value not drawn)
X?#6  40 pin header  [40 PIN HEADER]  (value not drawn)  (part A of 2)
X?#7  40 pin socket  [40 PIN SOCKET]  (value not drawn)  (part A of 2)
X?#8  40 pin header  [40 PIN HEADER]  (value not drawn)  (part B of 2)
X?#9  40 pin header  [40 PIN HEADER]  (value not drawn)  (part A of 2)
X?#10  40 pin header  [40 PIN HEADER]  (value not drawn)  (part B of 2)
X?#11  40 pin socket  [40 PIN SOCKET]  (value not drawn)  (part B of 2)
X?#12  40 pin socket  [40 PIN SOCKET]  (value not drawn)  (part B of 2)
X?#13  40 pin socket  [40 PIN SOCKET]  (value not drawn)  (part A of 2)
Z?  Crystal resonator 25 MHz  [HC49/S (CRYSTAL)]  (value not drawn)

## Nets
+1.0В: C?#25.2 C?#62.1 C?#63.2 C?#64.1 C?#65.1 C?#66.2 C?#67.2 C?#68.2 C?#69.2 DD?#9.E10(VCCBRAM) DD?#9.F7(VCCINT) DD?#9.F9(VCCINT) DD?#9.F11(VCCBRAM) DD?#9.G6(VCCINT) DD?#9.H9(VCCINT) DD?#9.J6(VCCINT) DD?#9.K9(VCCINT) DD?#9.L8(VCCINT) R?#9.2 R?#13.2
+1.2В: C?#6.2 C?#7.2 C?#8.2 C?#9.2 C?#10.2 C?#11.2 C?#18.2 C?#19.2 C?#20.2 C?#21.1 C?#22.2 C?#23.2 C?#51.2 L?#3.2 L?#4.2 L?#7.2 R?#77.2 R?#78.2
+1.8В: C?#32.2 C?#55.1 C?#56.2 C?#57.2 C?#58.2 C?#59.2 C?#60.2 DD?#9.F8(VCCBATT_0) DD?#9.G8(VCCADC_0) DD?#9.G10(VCCAUX) DD?#9.J10(VCCAUX) DD?#9.K11(VCCAUX) DD?#9.L10(VCCAUX) R?#24.2
+2.5В: C?#2.1 C?#3.1 C?#4.1 C?#5.2 C?#15.1 C?#16.1 C?#17.2 C?#30.2 C?#31.2 C?#37.2 C?#92.1 C?#93.2 C?#94.2 C?#95.2 C?#96.2 C?#97.2 C?#98.2 DA?#3.2(SEL) DA?#3.5(VDD) DD?#9.A6(VCCO_35) DD?#9.B3(VCCO_35) DD?#9.D7(VCCO_35) DD?#9.E4(VCCO_35) DD?#9.F1(VCCO_35) DD?#9.J2(VCCO_35) L?#2.2 L?#5.2 R?#18.2 R?#19.2 R?#29.1 R?#30.1 R?#31.1 R?#32.1 R?#38.2 R?#50.2
+3.3В: C?#12.2 C?#13.1 C?#14.1 C?#24.1 C?#29.1 C?#33.1 C?#34.1 C?#35.1 C?#42.1 C?#43.1 C?#44.1 C?#46.2 C?#47.1 C?#48.1 C?#49.1 C?#49.2 C?#50.2 C?#52.1 C?#53.1 C?#54.1 C?#55.2 C?#56.1 C?#57.1 C?#58.1 C?#59.1 C?#60.1 C?#61.2 C?#62.2 C?#63.1 C?#64.2 C?#65.2 C?#66.1 C?#67.1 C?#68.1 C?#69.1 C?#70.1 C?#70.2 C?#71.1 C?#71.2 C?#72.1 C?#72.2 C?#73.1 C?#73.2 C?#74.1 C?#74.2 C?#75.1 C?#75.2 C?#76.1 C?#76.2 C?#77.1 C?#77.2 C?#78.1 C?#78.2 C?#79.1 C?#79.2 C?#80.1 C?#80.2 C?#81.1 C?#81.2 C?#82.1 C?#82.2 C?#83.1 C?#83.2 C?#84.1 C?#84.2 C?#85.1 C?#85.2 C?#86.1 C?#86.2 C?#87.1 C?#87.2 C?#88.1 C?#88.2 C?#89.1 C?#89.2 C?#90.1 C?#90.2 C?#91.1 C?#91.2 C?#92.2 C?#93.1 C?#94.1 C?#95.1 C?#96.1 C?#97.1 C?#98.1 DA?#1.4(GND) DA?#2.2(GND) DA?#4.2(GND) DA?#6.2(GND) DA?#7.4(GND) DA?#8.2(GND) DD?#1.E7(CFGBVS_0) DD?#1.H7(VREFN_0) DD?#1.H8(VP_0) DD?#1.J7(VN_0) DD?#1.J8(VREFP_0) DD?#1.K7(DXN_0) DD?#1.K8(DXP_0) DD?#1.M9(M0_0) DD?#4.4(VCC) DD?#7.8 DD?#9.A1(GND) DD?#9.A11(GND) DD?#9.A16(VCCO_15) DD?#9.B8(GND) DD?#9.B13(VCCO_15) DD?#9.C5(GND) DD?#9.C10(VCCO_15) DD?#9.C15(GND) DD?#9.D2(GND) DD?#9.D12(GND) DD?#9.E9(GND) DD?#9.E14(VCCO_15) DD?#9.F6(GND) DD?#9.F10(GND) DD?#9.F16(GND) DD?#9.G3(GND) DD?#9.G7(GNDADC_0) DD?#9.G9(GND) DD?#9.G13(GND) DD?#9.H6(GND) DD?#9.H15(VCCO_15) DD?#9.J9(GND) DD?#9.J11(GND) DD?#9.J12(VCCO_15) DD?#9.K4(GND) DD?#9.K6(GND) DD?#9.K14(GND) DD?#9.L1(GND) DD?#9.L6(VCCO_0) DD?#9.L11(GND) DD?#9.L16(VCCO_14) DD?#9.M3(VCCO_34) DD?#9.M8(GND) DD?#9.M13(VCCO_14) DD?#9.N5(GND) DD?#9.N10(VCCO_14) DD?#9.N15(GND) DD?#9.P2(GND) DD?#9.P7(VCCO_14) DD?#9.P12(GND) DD?#9.R4(VCCO_34) DD?#9.R9(GND) DD?#9.R14(VCCO_14) DD?#9.T1(VCCO_34) DD?#9.T6(GND) DD?#9.T11(VCCO_14) DD?#9.T16(GND) R?#7.1 R?#8.1 R?#10.2 R?#11.2 R?#12.2 R?#15.1 R?#16.1 R?#17.1 R?#20.2 R?#21.2 R?#35.1 R?#63.1 R?#66.2 R?#68.2 R?#70.2 R?#71.2 R?#72.2 R?#73.2 R?#74.2 R?#75.2 R?#76.2 R?#81.1 VD?#2.1(K) VD?#6.1(K) VD?#7.1(K) VD?#8.1(K) X?#1.1,2(GND) X?#2.2(VREF_(VCCO)) X?#3.A12(GND) X?#3.B12(GND) X?#4.1(VCC) X?#6.2 X?#7.2 X?#8.21 X?#8.32 X?#9.2 X?#12.21 X?#13.2  [also labelled GND]
+5В: C?#24.2 C?#34.2 C?#43.2 C?#47.2 C?#53.2 DA?#2.1(EN) DA?#2.4(VIN) DA?#4.4(VIN) DA?#6.4(VIN) DA?#7.2(IN) DA?#8.4(VIN) R?#4.2 R?#25.2 R?#51.2 R?#65.2 R?#79.2 VD?#1.1(C) VD?#5.1(C) X?#6.1 X?#7.1 X?#9.1 X?#13.1
CCLK: DD?#1.E8(CCLK_0) DD?#7.6
LED_G: DD?#2.15(LED2) R?#53.1 X?#5.9
LED_Y: DD?#2.17(LED1) R?#18.1 X?#5.11
MDC: DD?#2.36(MDC) DD?#3.C2(IO_L7N_T1_AD6N_35)
MDIO: DD?#2.37(MDIO) DD?#3.C3(IO_L7P_T1_AD6P_35) R?#38.1
NetC?#2_2: C?#2.2 C?#3.2 C?#4.2 C?#5.1 C?#6.1 C?#7.1 C?#8.1 C?#9.1 C?#10.1 C?#11.1 C?#15.2 C?#16.2 C?#17.1 C?#18.1 C?#19.1 C?#20.1 C?#21.2 C?#22.1 C?#23.1 C?#26.1 C?#27.1 C?#28.1 C?#30.1 C?#31.1 C?#36.1 C?#38.1 C?#39.1 C?#40.1 C?#41.1 C?#50.1 C?#61.1 DA?#3.3(GND) DD?#1.M10(M1_0) DD?#2.29(VSS) DD?#2.49(P_VSS) DD?#4.2(GND) DD?#7.4 R?#52.2 R?#53.2 R?#55.2 R?#56.2 R?#57.2 R?#58.2 R?#59.2 R?#60.2 R?#61.1 R?#62.1 R?#82.1 SW?.1 X?#2.7(GND) X?#4.3(GND) X?#5.S1,S2(S1) X?#10.21 X?#11.21 X?#11.31 X?#11.32
A2: DD?#3.A2(IO_L8N_T1_AD14N_35) X?#8.40
A3: DD?#3.A3(IO_L4N_T0_35) X?#11.22
A4: DD?#3.A4(IO_L3N_T0_DQS_AD5N_35) X?#11.24
A5: DD?#3.A5(IO_L3P_T0_DQS_AD5P_35) X?#11.26
A7: DD?#3.A7(IO_L1N_T0_AD4N_35) X?#11.30
A8: DD?#5.A8(IO_L2P_T0_AD8P_15) X?#11.33
A9: DD?#5.A9(IO_L2N_T0_AD8N_15) X?#11.35
A10: DD?#5.A10(IO_L3N_T0_DQS_AD1N_15) X?#11.36
A12: DD?#5.A12(IO_L5N_T0_AD9N_15) X?#11.37
A13: DD?#5.A13(IO_L7P_T1_AD2P_15) X?#11.38
A14: DD?#5.A14(IO_L7N_T1_AD2N_15) X?#11.39
A15: DD?#5.A15(IO_L9N_T1_DQS_AD3N_15) X?#11.40
B1: DD?#3.B1(IO_L9N_T1_DQS_AD7N_35) X?#8.39
B2: DD?#3.B2(IO_L8P_T1_AD14P_35) X?#8.38
B4: DD?#3.B4(IO_L4P_T0_35) X?#11.23
B5: DD?#3.B5(IO_L2N_T0_AD12N_35) X?#11.25
B6: DD?#3.B6(IO_L2P_T0_AD12P_35) X?#11.28
B9: DD?#5.B9(IO_L3P_T0_DQS_AD1P_15) X?#11.34
B10: DD?#5.B10(IO_L4P_T0_15) X?#7.8
B11: DD?#5.B11(IO_L4N_T0_15) X?#7.11
B12: DD?#5.B12(IO_L5P_T0_AD9P_15) X?#7.13
B14: DD?#5.B14(IO_L8N_T1_AD10N_15) X?#7.17
B15: DD?#5.B15(IO_L9P_T1_DQS_AD3P_15) X?#7.18
B16: DD?#5.B16(IO_L10N_T1_AD11N_15) X?#7.20
C1: DD?#3.C1(IO_L9P_T1_DQS_AD7P_35) X?#8.37
C4: DD?#3.C4(IO_L12N_T1_MRCC_35) X?#6.20
C6: DD?#3.C6(IO_L5N_T0_AD13N_35) X?#11.27
C7: DD?#3.C7(IO_L5P_T0_AD13P_35) X?#11.29
C8: DD?#5.C8(IO_L1P_T0_AD0P_15) X?#7.4
C9: DD?#5.C9(IO_L1N_T0_AD0N_15) X?#7.6
C11: DD?#5.C11(IO_L11P_T1_SRCC_15) X?#7.10
C12: DD?#5.C12(IO_L11N_T1_SRCC_15) X?#7.12
C13: DD?#5.C13(IO_L12N_T1_MRCC_15) X?#7.15
C14: DD?#5.C14(IO_L8P_T1_AD10P_15) X?#7.16
C16: DD?#5.C16(IO_L10P_T1_AD11P_15) X?#7.19
D1: DD?#3.D1(IO_L10N_T1_AD15N_35) X?#8.36
D3: DD?#3.D3(IO_L11N_T1_SRCC_35) X?#6.19
D4: DD?#3.D4(IO_L12P_T1_MRCC_35) X?#6.18
D5: DD?#3.D5(IO_L6N_T0_VREF_35) X?#6.17
D6: DD?#3.D6(IO_L6P_T0_35) X?#6.16
D8: DD?#5.D8(IO_L6P_T0_15) X?#7.3
D9: DD?#5.D9(IO_L6N_T0_VREF_15) X?#7.5
D10: DD?#5.D10(IO_0_15) X?#7.7
D11: DD?#5.D11(IO_L14N_T2_SRCC_15) X?#7.9
D13: DD?#5.D13(IO_L12P_T1_MRCC_15) X?#7.14
D14: DD?#5.D14(IO_L15P_T2_DQS_15) X?#9.3
D15: DD?#5.D15(IO_L15N_T2_DQS_ADV_B_15) X?#10.22
D16: DD?#5.D16(IO_L17N_T2_A25_15) X?#10.23
E2: DD?#3.E2(IO_L10P_T1_AD15P_35) X?#8.35
E3: DD?#3.E3(IO_L11P_T1_SRCC_35) X?#6.15
E5: DD?#3.E5(IO_L13N_T2_MRCC_35) X?#6.14
E11: DD?#5.E11(IO_L14P_T2_SRCC_15) X?#9.4
E12: DD?#5.E12(IO_L13P_T2_MRCC_15) X?#9.5
E13: DD?#5.E13(IO_L13N_T2_MRCC_15) X?#9.6
E15: DD?#5.E15(IO_L18N_T2_A23_15) X?#10.24
E16: DD?#5.E16(IO_L17P_T2_A26_15) X?#10.25
F3: DD?#3.F3(IO_L14N_T2_SRCC_35) X?#8.34
F5: DD?#3.F5(IO_L13P_T2_MRCC_35) X?#6.13
F12: DD?#5.F12(IO_L16P_T2_A28_15) X?#9.7
F13: DD?#5.F13(IO_L16N_T2_A27_15) X?#9.8
F14: DD?#5.F14(IO_L21N_T3_DQS_A18_15) X?#9.9
F15: DD?#5.F15(IO_L18P_T2_A24_15) X?#10.26
G11: DD?#5.G11(IO_25_15) X?#9.10
G12: DD?#5.G12(IO_L19N_T3_A21_VREF_15) X?#9.11
G14: DD?#5.G14(IO_L21P_T3_DQS_15) X?#9.12
G15: DD?#5.G15(IO_L24N_T3_RS0_15) X?#10.27
G16: DD?#5.G16(IO_L22N_T3_A16_15) X?#10.28
H1: DD?#3.H1(IO_L20N_T3_35) X?#8.33
H3: DD?#3.H3(IO_L21N_T3_DQS_35) X?#8.31
H4: DD?#3.H4(IO_L18N_T2_35) X?#6.12
H5: DD?#3.H5(IO_L18P_T2_35) X?#6.11
H11: DD?#5.H11(IO_L19P_T3_A22_15) X?#9.13
H12: DD?#5.H12(IO_L20P_T3_A20_15) X?#9.14
H13: DD?#5.H13(IO_L20N_T3_A19_15) X?#9.15
H14: DD?#5.H14(IO_L24P_T3_RS1_15) X?#9.16
H16: DD?#5.H16(IO_L22P_T3_A17_15) X?#10.29
J3: DD?#3.J3(IO_L21P_T3_DQS_35) X?#8.30
J4: DD?#3.J4(IO_L19N_T3_VREF_35) X?#6.10
J5: DD?#3.J5(IO_L19P_T3_35) X?#6.9
J15: DD?#5.J15(IO_L23P_T3_FOE_B_15) X?#9.17
J16: DD?#5.J16(IO_L23N_T3_FWE_B_15) X?#10.30
K1: DD?#3.K1(IO_L22P_T3_35) X?#8.29
K12: DD?#6.K12(IO_0_14) X?#9.18
K13: DD?#6.K13(IO_L5P_T0_D06_14) X?#9.19
L4: DD?#8.L4(IO_L1P_T0_34) X?#6.8
L5: DD?#8.L5(IO_0_34) X?#6.7
L13: DD?#6.L13(IO_L5N_T0_D07_14) X?#10.31
L14: DD?#6.L14(IO_L4P_T0_D04_14) X?#10.32
M1: DD?#8.M1(IO_L2N_T0_34) X?#8.28
M2: DD?#8.M2(IO_L2P_T0_34) X?#8.27
M4: DD?#8.M4(IO_L1N_T0_34) X?#6.6
M5: DD?#6.M6(IO_L19P_T3_A10_D26_14) DD?#8.M5(IO_L6P_T0_34) X?#6.5 X?#13.17  [also labelled M6]
M12: DD?#6.M12(IO_L6N_T0_D08_VREF_14) X?#9.20
M14: DD?#6.M14(IO_L4N_T0_D05_14) X?#10.33
M15: DD?#6.M15(IO_L3N_T0_DQS_EMCCLK_14) X?#10.34
M16: DD?#6.M16(IO_L7P_T1_D09_14) X?#10.35
MX1+: DA?#5.23 X?#5.1
MX1-: DA?#5.22 X?#5.2
MX2+: DA?#5.20 X?#5.3
MX2-: DA?#5.19 X?#5.6
MX3+: DA?#5.17 X?#5.4
MX3-: DA?#5.16 X?#5.5
MX4+: DA?#5.14 X?#5.7
MX4-: DA?#5.13 X?#5.8
N1: DD?#8.N1(IO_L4P_T0_34) X?#8.26
N2: DD?#8.N2(IO_L3N_T0_DQS_34) X?#8.25
N3: DD?#8.N3(IO_L3P_T0_DQS_34) X?#6.4
N4: DD?#8.N4(IO_L6N_T0_VREF_34) X?#6.3
N6: DD?#6.N6(IO_L19N_T3_A09_D25_VREF_14) X?#13.16
N9: DD?#6.N9(IO_L18P_T2_A12_D28_14) X?#13.13
N12: DD?#6.N12(IO_L13N_T2_MRCC_14) X?#13.9
N13: DD?#6.N13(IO_L11P_T1_SRCC_14) X?#10.36
N14: DD?#6.N14(IO_L12P_T1_MRCC_14) X?#10.37
N16: DD?#6.N16(IO_L7N_T1_D10_14) X?#10.38
P1: DD?#8.P1(IO_L4N_T0_34) X?#8.24
P3: DD?#8.P3(IO_L5N_T0_34) X?#8.23
P4: DD?#8.P4(IO_L5P_T0_34) X?#13.19
P5: DD?#8.P5(IO_L10P_T1_34) X?#13.18
P6: DD?#6.P6(IO_25_14) X?#13.15
P8: DD?#6.P8(IO_L20P_T3_A08_D24_14) X?#13.14
P9: DD?#6.P9(IO_L18N_T2_A11_D27_14) X?#13.12
P10: DD?#6.P10(IO_L14P_T2_SRCC_14) X?#13.11
P11: DD?#6.P11(IO_L14N_T2_SRCC_14) X?#13.10
P13: X?#13.7
P14: DD?#6.P14(IO_L12N_T1_MRCC_14) X?#13.5
P15: DD?#6.P15(IO_L8P_T1_D11_14) X?#13.4
P16: DD?#6.P16(IO_L8N_T1_D12_14) X?#10.39
R1: DD?#8.R1(IO_L7N_T1_34) X?#8.22
R2: DD?#8.R2(IO_L7P_T1_34) X?#12.40
R3: DD?#8.R3(IO_L8P_T1_34) X?#13.20
R5: DD?#6.R5(IO_L23P_T3_A03_D19_14) X?#12.36
R6: DD?#6.R6(IO_L24P_T3_A01_D17_14) X?#12.34
R7: DD?#6.R7(IO_L24N_T3_A00_D16_14) X?#12.33
R8: DD?#6.R8(IO_L20N_T3_A07_D23_14) X?#12.31
R10: DD?#6.R10(IO_L17P_T2_A14_D30_14) X?#12.28
R11: DD?#6.R11(IO_L17N_T2_A13_D29_14) X?#12.26
R12: DD?#6.R12(IO_L15P_T2_DQS_RDWR_B_14) X?#13.8
R13: DD?#6.R13(IO_L16P_T2_CSI_B_14) X?#13.6
R15: DD?#6.P13(IO_L11N_T1_SRCC_14) DD?#6.R15(IO_L9P_T1_DQS_14) X?#13.3
R16: DD?#6.R16(IO_L9N_T1_DQS_D13_14) X?#10.40
RX_CTL: DD?#3.J1(IO_L22N_T3_35) R?#36.2
RXD0: DD?#3.L3(IO_L23P_T3_35) R?#45.2
RXD1: DD?#3.L2(IO_L23N_T3_35) R?#47.2
RXD2: DD?#3.K3(IO_L24P_T3_35) R?#48.2
RXD3: DD?#3.K2(IO_L24N_T3_35) R?#49.2
T2: DD?#8.T2(IO_L8N_T1_34) X?#12.39
T3: DD?#8.T3(IO_L9N_T1_DQS_34) X?#12.38
T4: DD?#8.T4(IO_L9P_T1_DQS_34) X?#12.37
T5: DD?#6.T5(IO_L23N_T3_A02_D18_14) X?#12.35
T7: DD?#6.T7(IO_L21P_T3_DQS_14) X?#12.32
T8: DD?#6.T8(IO_L21N_T3_DQS_A06_D22_14) X?#12.30
T9: DD?#6.T9(IO_L22P_T3_A05_D21_14) X?#12.29
T10: DD?#6.T10(IO_L22N_T3_A04_D20_14) X?#12.27
T12: DD?#6.T12(IO_L15N_T2_DQS_DOUT_CSO_B_14) X?#12.25
T13: DD?#6.T13(IO_L16N_T2_A15_D31_14) X?#12.24
T14: DD?#6.T14(IO_L10P_T1_D14_14) X?#12.23
T15: DD?#6.T15(IO_L10N_T1_D15_14) X?#12.22
TD1+: DA?#5.2 DD?#2.2(TXRXP_A)
TD1-: DA?#5.3 DD?#2.3(TXRXM_A)
TD2+: DA?#5.5 DD?#2.5(TXRXP_B)
TD2-: DA?#5.6 DD?#2.6(TXRXM_B)
TD3+: DA?#5.8 DD?#2.7(TXRXP_C)
TD3-: DA?#5.9 DD?#2.8(TXRXM_B)
TD4+: DA?#5.11 DD?#2.10(TXRXP_D)
TD4-: DA?#5.12 DD?#2.11(TXRXM_D)
TX_CTL: DD?#2.25(TXCTL) R?#28.1
TXCLK: DD?#2.24(TXCLK) R?#33.1
TXD0: DD?#2.19(TXD0) R?#34.1
TXD1: DD?#2.20(TXD1) R?#37.1
TXD2: DD?#2.21(TXD2) R?#40.1
TXD3: DD?#2.22(TXD3) R?#46.1
NetC?#1_1: C?#1.1 DA?#1.3(SW) L?#1.1
NetC?#1_2: C?#1.2 R?#1.2
NetC?#12_1: C?#12.1 DA?#1.7(VCC)
NetC?#13_2: C?#13.2 DA?#1.2(IN) R?#2.2 X?#1.3(VCC)
NetC?#14_2: C?#14.2 R?#3.2 VD?#1.2(A)
NetC?#25_1: C?#25.1 DA?#2.5(FB) R?#14.1 R?#17.2
NetC?#26_2: C?#26.2 DD?#1.L9(PROG_B_0) DD?#2.42(RESET_N) DD?#3.H2(IO_L20P_T3_35) R?#12.1 SW?.2
NetC?#27_2: C?#27.2 DD?#2.46(XI) Z?.1
NetC?#28_2: C?#28.2 DD?#2.45(XO) Z?.2
NetC?#29_2: C?#29.2 L?#6.2 R?#9.1 R?#14.2
NetC?#32_1: C?#32.1 DA?#4.5(FB) R?#27.1 R?#35.2
NetC?#33_2: C?#33.2 DA?#4.1(EN) R?#25.1
NetC?#35_2: C?#35.2 L?#8.2 R?#24.1 R?#27.2
NetC?#36_2: C?#36.2 R?#41.1 R?#42.1 R?#43.1 R?#44.1
NetC?#37_1: C?#37.1 DA?#6.5(FB) R?#54.1 R?#63.2
NetC?#38_2: C?#38.2 DA?#5.1
NetC?#39_2: C?#39.2 DA?#5.4
NetC?#40_2: C?#40.2 DA?#5.7
NetC?#41_2: C?#41.2 DA?#5.10
NetC?#42_2: C?#42.2 DA?#6.1(EN) R?#51.1
NetC?#44_2: C?#44.2 L?#9.2 R?#50.1 R?#54.2
NetC?#45_1: C?#45.1 DA?#7.3(SW) L?#10.1
NetC?#45_2: C?#45.2 R?#64.2
NetC?#46_1: C?#46.1 DA?#7.7(VCC)
NetC?#48_2: C?#48.2 DA?#7.6(EN/SYNC) R?#65.1
NetC?#51_1: C?#51.1 DA?#8.5(FB)
NetC?#52_2: C?#52.2 DA?#8.1(EN) R?#79.1
NetC?#54_2: C?#54.2 L?#11.2 R?#77.1 R?#80.2
NetDA?#1_1: DA?#1.1(AAM) R?#7.2
NetDA?#1_5: DA?#1.5(BST) R?#1.1
NetDA?#1_6: DA?#1.6(EN/SYNC) R?#2.1
NetDA?#1_8: DA?#1.8(FB) R?#5.1
NetDA?#2_3: DA?#2.3(SW) L?#6.1
NetDA?#3_1: DA?#3.1(WS) R?#22.2
NetDA?#3_4: DA?#3.4(BCLK) R?#23.2
NetDA?#3_6: DA?#3.6(DO) R?#26.2
NetDA?#4_3: DA?#4.3(SW) L?#8.1
NetDA?#5_15: DA?#5.15 R?#44.2
NetDA?#5_18: DA?#5.18 R?#43.2
NetDA?#5_21: DA?#5.21 R?#42.2
NetDA?#5_24: DA?#5.24 R?#41.2
NetDA?#6_3: DA?#6.3(SW) L?#9.1
NetDA?#7_1: DA?#7.1(AAM) R?#71.1
NetDA?#7_5: DA?#7.5(BST) R?#64.1
NetDA?#7_8: DA?#7.8(FB) R?#67.1
NetDA?#8_3: DA?#8.3(SW) L?#11.1
NetDD?#1_H10: DD?#1.H10(DONE_0) VD?#3.1(K)
NetDD?#1_K10: DD?#1.K10(INIT_B_0) VD?#4.1(K)
NetDD?#1_L7: DD?#1.L7(TCK_0) X?#2.6(TCK)
NetDD?#1_M7: DD?#1.M7(TMS_0) X?#2.4(TMS)
NetDD?#1_M11: DD?#1.M11(M2_0) X?#4.2(M[2])
NetDD?#1_N7: DD?#1.N7(TDI_0) X?#2.10(TDI)
NetDD?#1_N8: DD?#1.N8(TDO_0) X?#2.8(TDO)
NetDD?#2_1, 12: DD?#2.1,_12(AVDDH) L?#5.1
NetDD?#2_4,9: DD?#2.4,9(AVDDL) L?#4.1
NetDD?#2_16,34,40: DD?#2.16,34,40(DVDDH) L?#2.1
NetDD?#2_18,23,26,30,39: DD?#2.18,23,26,30,39(DVDDL) L?#3.1
NetDD?#2_27: DD?#2.27(RXD3) R?#29.2 R?#49.1 R?#55.1
NetDD?#2_28: DD?#2.28(RXD2) R?#30.2 R?#48.1 R?#56.1
NetDD?#2_31: DD?#2.31(RXD1) R?#31.2 R?#47.1 R?#57.1
NetDD?#2_32: DD?#2.32(RXD0) R?#32.2 R?#45.1 R?#58.1
NetDD?#2_33: DD?#2.33(RX_CTL) R?#36.1 R?#60.1
NetDD?#2_35: DD?#2.35(RXCLK) R?#39.1 R?#59.1
NetDD?#2_38: DD?#2.38(INT_N) R?#19.1 R?#62.2
NetDD?#2_41: DD?#2.41(CLK125_NDO) R?#61.2
NetDD?#2_44: DD?#2.44(AVDDL_PLL) L?#7.1
NetDD?#2_48: DD?#2.48(ISET) R?#52.1
NetDD?#3_B7: DD?#3.B7(IO_L1P_T0_AD4P_35) R?#26.1
NetDD?#3_E1: DD?#3.E1(IO_L15N_T2_DQS_35) R?#33.2
NetDD?#3_E6: DD?#3.E6(IO_0_35) R?#22.1
NetDD?#3_F2: DD?#3.F2(IO_L15P_T2_DQS_35) R?#28.2
NetDD?#3_F4: DD?#3.F4(IO_L14P_T2_SRCC_35) R?#39.2
NetDD?#3_G1: DD?#3.G1(IO_L17N_T2_35) R?#46.2
NetDD?#3_G2: DD?#3.G2(IO_L17P_T2_35) R?#40.2
NetDD?#3_G4: DD?#3.G4(IO_L16N_T2_35) R?#37.2
NetDD?#3_G5: DD?#3.G5(IO_L16P_T2_35) R?#34.2
NetDD?#3_K5: DD?#3.K5(IO_25_35) R?#23.1
NetDD?#4_1: DD?#4.1(OE) R?#70.1
NetDD?#4_3: DD?#4.3(OUT) DD?#6.N11(IO_L13P_T2_MRCC_14)
NetDD?#6_J13: DD?#6.J13(IO_L1P_T0_D00_MOSI_14) DD?#7.5
NetDD?#6_J14: DD?#6.J14(IO_L1N_T0_D01_DIN_14) DD?#7.2
NetDD?#6_K15: DD?#6.K15(IO_L2P_T0_D02_14) DD?#7.3 R?#76.1
NetDD?#6_K16: DD?#6.K16(IO_L2N_T0_D03_14) DD?#7.7 R?#75.1
NetDD?#6_L12: DD?#6.L12(IO_L6P_T0_FCS_B_14) DD?#7.1 R?#73.1
NetDD?#6_L15: DD?#6.L15(IO_L3P_T0_DQS_PUDC_B_14) R?#74.1 R?#82.2
NetL?#1_2: L?#1.2 R?#3.1 R?#6.2
NetL?#10_2: L?#10.2 R?#66.1 R?#69.2
NetR?#4_1: R?#4.1 VD?#2.2(A)
NetR?#5_2: R?#5.2 R?#6.1 R?#8.2
NetR?#10_1: R?#10.1 VD?#3.2(A)
NetR?#11_1: R?#11.1 VD?#4.2(A)
NetR?#13_1: R?#13.1 VD?#6.2(A)
NetR?#15_2: R?#15.2 X?#3.B5(CC2)
NetR?#16_2: R?#16.2 X?#3.A5(CC1)
NetR?#20_1: R?#20.1 X?#5.12
NetR?#21_1: R?#21.1 X?#5.10
NetR?#67_2: R?#67.2 R?#69.1 R?#72.1
NetR?#68_1: R?#68.1 VD?#7.2(A)
NetR?#78_1: R?#78.1 VD?#8.2(A)
NetR?#80_1: R?#80.1 R?#81.2
NetVD?#5_2: VD?#5.2(A) X?#3.A9(VBUS) X?#3.B9(VBUS)

Not connected (* = marked no-connect by the designer): DD?#2 43(LDO)

## Notes on the sheet
- CONFIG JTAG
- JUMPER
- (near R?#19) *2
- (near R?#19) Х
- (near DA?#3) MICRO
- (near R?#32) Х
- left header
- (near R?#55) Х
- (near R?#56) Х
- (near R?#57) Х
- (near R?#57) *3
- ETHERNET
- top socket
- 1
- (near DD?#4) OSC
- right header
- 2
- CONFIG SPI
- (near R?#82) *1
- POWER
- FLASH
- bottom socket
- *1 - при пайке оставить один резистор (скорее всего, подтяжку к 3.3В)
- *2: 0 - отвечает на свой адрес и на 0; 1 - отвечает только на свой адроес
- *3 - '1110' - tri-mode
- Х - не паять
- Перв. примен.
- Справ. №
- Подп. и дата
- Инв. № дубл.
- Взам. инв. №
- Разраб.
- Изм.
- Лист
- № докум.
- Подп.
- Дата
- Лит.
- Масса
- Масштаб
- Пров.
- Т.контр.
- Листов
- Инв. № подл.
- Утв.
- Н.контр.
- 2.106-A1
- Копировал
- Формат А0
- (in symbol DC3-14P) Цепь; Конт.; +3.3 В; 1; 3; 5; Общий
- (in symbol DC Power Jack) Цепь; Конт.; 1; +12В; Общий; 2
- (in symbol DS1021-1*3SF11-B) Цепь; Конт.; +3.3 В; M[0]; Общий
- (in symbol DS1021-2X20SF11-B, part A) Конт.; Цепь; +5В; +3.3В
- (in symbol DS1021-2X20SF11-B, part B) Цепь; Конт.; Общий
- (in symbol DS1023-2X20S21, part A) Конт.; Цепь; +5В; +3.3В
- (in symbol DS1023-2X20S21, part B) Конт.; Цепь; Общий
- (in symbol HX5008NLT) TCT1; *TR; MCT1; TD1+; MX1+; TD1-; MX1-; TCT2; MCT2; TD2+; MX2+; TD2-; MX2-; TCT3; MCT3; TD3+; MX3+; TD3-; MX3-; TCT4; MCT4; TD4+; MX4+; TD4-; MX4-
- (in symbol KSZ9131RXNI) RTX; TX_CTL; INT_N/PME_N2/ALLPHYAD; CLK125_NDO/LED_MODE; RX_CTL/CLK125_EN; RXCLK/PHYAD2; TXRXM_C; RXD0/MODE0; RXD1/MODE1; RXD2/MODE2; LED1/PME_N1/PHYAD0; RXD3/MODE3; LED2/PHYAD1; LDO_O
- (in symbol MP2315GJ) *STU
- (in symbol MX25L12835F) EEPROM; VCC; CS; RST/SIO3; SO/SIO1; SCLK; WP#/SIO2; SI/SIO0; GND
- (in symbol NCP1529) *STU
- (in symbol RJHSE-5381) Конт.; Цепь; TXRXP_A; TXRXM_A; TXRXP_B; TXRXP_C; TXRXM_C; TXRXM_B; TXRXP_D; TXRXM_D; LED_G-; LED_G+; LED_Y-; LED_Y+; 13; CT
- (in symbol SG-8018CA TJHPA) G
- (in symbol SPH0645LM4H) ADC
- (in symbol USB Type-C) Цепь; Конт.; +5В; 1; 2; СС1; 3; СС2; 4; Общий; 5; 6
- (in symbol XC7A35T-1FTG256C, part A) PLM
- (in symbol XC7A35T-1FTG256C, part B) PLM
- (in symbol XC7A35T-1FTG256C, part C) PLM
- (in symbol XC7A35T-1FTG256C, part D) PLM
- (in symbol XC7A35T-1FTG256C, part E) PLM
- (in symbol XC7A35T-1FTG256C, part F) PLM

## Library data of the parts
C?#1 C?#12 C?#26 C?#31 C?#38-C?#41 C?#45 C?#46 C?#50 C?#61 = GRM319R72A104KA01D: Компания: Murata; Напряжение: 25 В; Значение: 0.1 мкф
C?#2 C?#3 C?#5-C?#10 C?#15 C?#17-C?#19 C?#21 = CC0603KRX7R9BB104: Компания: Yageo; Напряжение: 50 В
C?#4 C?#16 C?#23 = CL10A106KQ8NNNC: 10 мкф 0603 X5R; Компания: Samsung; Напряжение: 6.3 В; Значение: 10 мкФ
C?#11 C?#20 = CL10A106KQ8NNNC_?????: 22 мкФ 0603 X5R; Компания: Samsung; Напряжение: 6.3 В; Значение: 22 мкФ
C?#13 C?#14 C?#47 C?#49 C?#56 C?#63 C?#70 C?#74 C?#79 C?#86 C?#93 = GRM31CR61E476ME44L: Компания: Murata; Напряжение: 25 В
  C?#13 C?#47 C?#56 C?#63 C?#70 C?#74 C?#79 C?#86 C?#93: Значение: 47 мкФ
C?#22 = CL10B103KB8NNND: 0.01 мкф 0603 X5R; Компания: Samsung; Напряжение: 50 В; Значение: 0.01 мкф
C?#24 C?#29 C?#34 C?#35 C?#43 C?#44 C?#53 C?#54 C?#57 C?#58 C?#66 C?#67 C?#71 C?#72 C?#83 C?#84 C?#87 C?#88 C?#94 C?#95 = GRM21BR71A475KA73L: Компания: Murata; Напряжение: 10 В
  C?#57 C?#58 C?#66 C?#67 C?#71 C?#72 C?#83 C?#84 C?#87 C?#88 C?#94 C?#95: Значение: 4.7 мкФ
C?#25 C?#30 C?#32 C?#37 C?#51 = GRM21BR61H270KA01D: Компания: Murata; Напряжение: 50 В
  C?#30: Значение: 27 пФ
C?#27 C?#28 = CC0603JRNPO9BN330: Компания: Yageo; Напряжение: 50 В
C?#33 C?#42 C?#48 C?#52 = CL10A106MQ8NNNC: 0603 X5R; Компания: Samsung; Напряжение: 6.3 В
C?#36 = CK45-B3DD102KYGNA: Компания: TDK; Напряжение: 2 кВ; Значение: 1000 пФ
C?#55 C?#59 C?#60 C?#62 C?#65 C?#68 C?#69 C?#73 C?#75-C?#78 C?#80-C?#82 C?#85 C?#89-C?#92 C?#96-C?#98 = GRM155R61A474K: Компания: Murata; Напряжение: 10 В; Значение: 0.47 мкФ
C?#64 = CL31A107MQHNNNE: Компания: Samsung; Напряжение: 6.3 В; Значение: 100 мкФ
DA?#1 DA?#7 = MP2315GJ: Компания: Monolithic
DA?#2 DA?#4 DA?#6 DA?#8 = NCP1529: Компания: ONSemi
DA?#3 = SPH0645LM4H: Компания: Knowles
DA?#5 = HX5008NLT: Компания: Pulse Electronics
DD?#1 DD?#3 DD?#5 DD?#6 DD?#8 DD?#9 = XC7A35T-1FTG256C: IC FPGA 170 I/O 256FTBGA; Компания: Xilinx
DD?#2 = KSZ9131RXNI: Компания: TI
DD?#4 = SG-8018CA TJHPA: Тип: Генератор
DD?#7 = MX25L12835F
L?#1 L?#6 L?#8-L?#11 = VLS6045EX-4R7M-H: Компания: TDK
L?#2-L?#5 L?#7 = MMZ1608Y221BT: Тип: Фильтр ферритовый; Компания: TDK
R?#1 R?#28 R?#33 R?#34 R?#36 R?#37 R?#39 R?#40 R?#45-R?#49 R?#64 = RC0805JR-0720RL: Компания: Yageo; Значение: 20 Ом
R?#2 R?#14 R?#25 R?#65 R?#80 R?#81 = RC2512FR-07120KL: Компания: Yageo
  R?#2 R?#65: Значение: 120 кОм
R?#3 R?#9 R?#24 R?#50 R?#66 R?#77 = RC0805JR-0RL: Компания: Yageo; Значение: 0 Ом
R?#4 R?#13 R?#20 R?#21 R?#68 R?#78 = RC0805FR-07220RL: Компания: Yageo; Значение: 220 Ом
R?#5 = RC0603FR-0720KL: Компания: Yageo; Значение: 20 кОм
R?#6 R?#69 = AF0603FR-0739KL: Компания: Yageo; Значение: 39 кОм
R?#7 R?#71 = 0805W8J0683T5E: Компания: Uniroyal; Значение: 68 кОм
R?#8 = RC0603FR-077K5L: Компания: Yageo; Значение: 7.5 кОм
R?#10 R?#11 R?#18 R?#19 R?#29-R?#32 R?#38 R?#53 R?#55-R?#62 R?#74 R?#82 = RS-06K102JT: Компания: Yageo; Значение: 1 кОм
R?#12 R?#70 R?#73 R?#75 R?#76 = RS-05K472JT: Компания: Yageo; Значение: 4.7 кОм
R?#15 R?#16 = RC0805FR-075K1L: 5.1 кОм 1%; Компания: Yageo; Значение: 5.1 кОм
R?#17 R?#35 R?#63 = RC2512FR-07180KL: Компания: Yageo
  R?#63: Значение: 180 кОм
R?#22 R?#23 R?#26 = RC0805FR-0751RL: Компания: Yageo; Значение: 51 Ом
R?#27 = RC2512FR-07360KL: Компания: Yageo
R?#41-R?#44 = RC1206JR-0775RL: Компания: Yageo; Значение: 75 Ом
R?#51 R?#79 = CR0805-JW-224ELF: Компания: Yageo
R?#52 = RC-02W6041FT: Компания: Fenghua; Значение: 6.04 кОм
R?#54 = RC0805FR-07560KL: Компания: Yageo; Значение: 560 кОм
R?#67 = RC0805FR-0733KL: Компания: Yageo; Значение: 33 кОм
R?#72 = RC0603FR-0712K4L: Компания: Yageo; Значение: 12.4 кОм
SW? = IT-1187-160GM-G: Компания: Switronic; Тип: Переключатель
VD?#1 VD?#5 = PMEG3050EP: Компания: Nexperia; Тип: Диод Шоттки
VD?#2 VD?#6-VD?#8 = TO-1608BC-PG: Компания: Oasis tech.
VD?#3 VD?#4 = TO-1608BC-BF: Компания: Oasis tech.
X?#1 = DC Power Jack: Тип: Разъем; Компания: *
X?#2 = DC3-14P: Компания: Китай; Тип: Разъем
X?#3 = USB Type-C: Тип: Разъем; Компания: *
X?#4 = DS1021-1*3SF11-B: Компания: Connfly; Тип: Разъем
X?#5 = RJHSE-5381: Компания: Amphenol; Тип: Разъем
X?#6 X?#8-X?#10 = DS1021-2X20SF11-B: Компания: Connfly; Тип: Разъем
X?#7 X?#11-X?#13 = DS1023-2X20S21: Компания: Connfly; Тип: Разъем
Z? = WTL9S85401FO: Тип: Кварцевый резонатор; Компания: WTL